# EasyEDA Pro project NewTalphaTHM.eprj

# Schematic THM V2

## Sheets
1 MainBoard: Create Date: 2023-01-20; Page Name: MainBoard; Project Name: NewTalphaTHM; Schematic Name: THM V2; Update Date: 2023-04-03; Company: PT AKA; Drawed: Hanif Fadh; Page Size: A4; Part Number: THM-1; Reviewed: Hanif Fadh; Version: V2
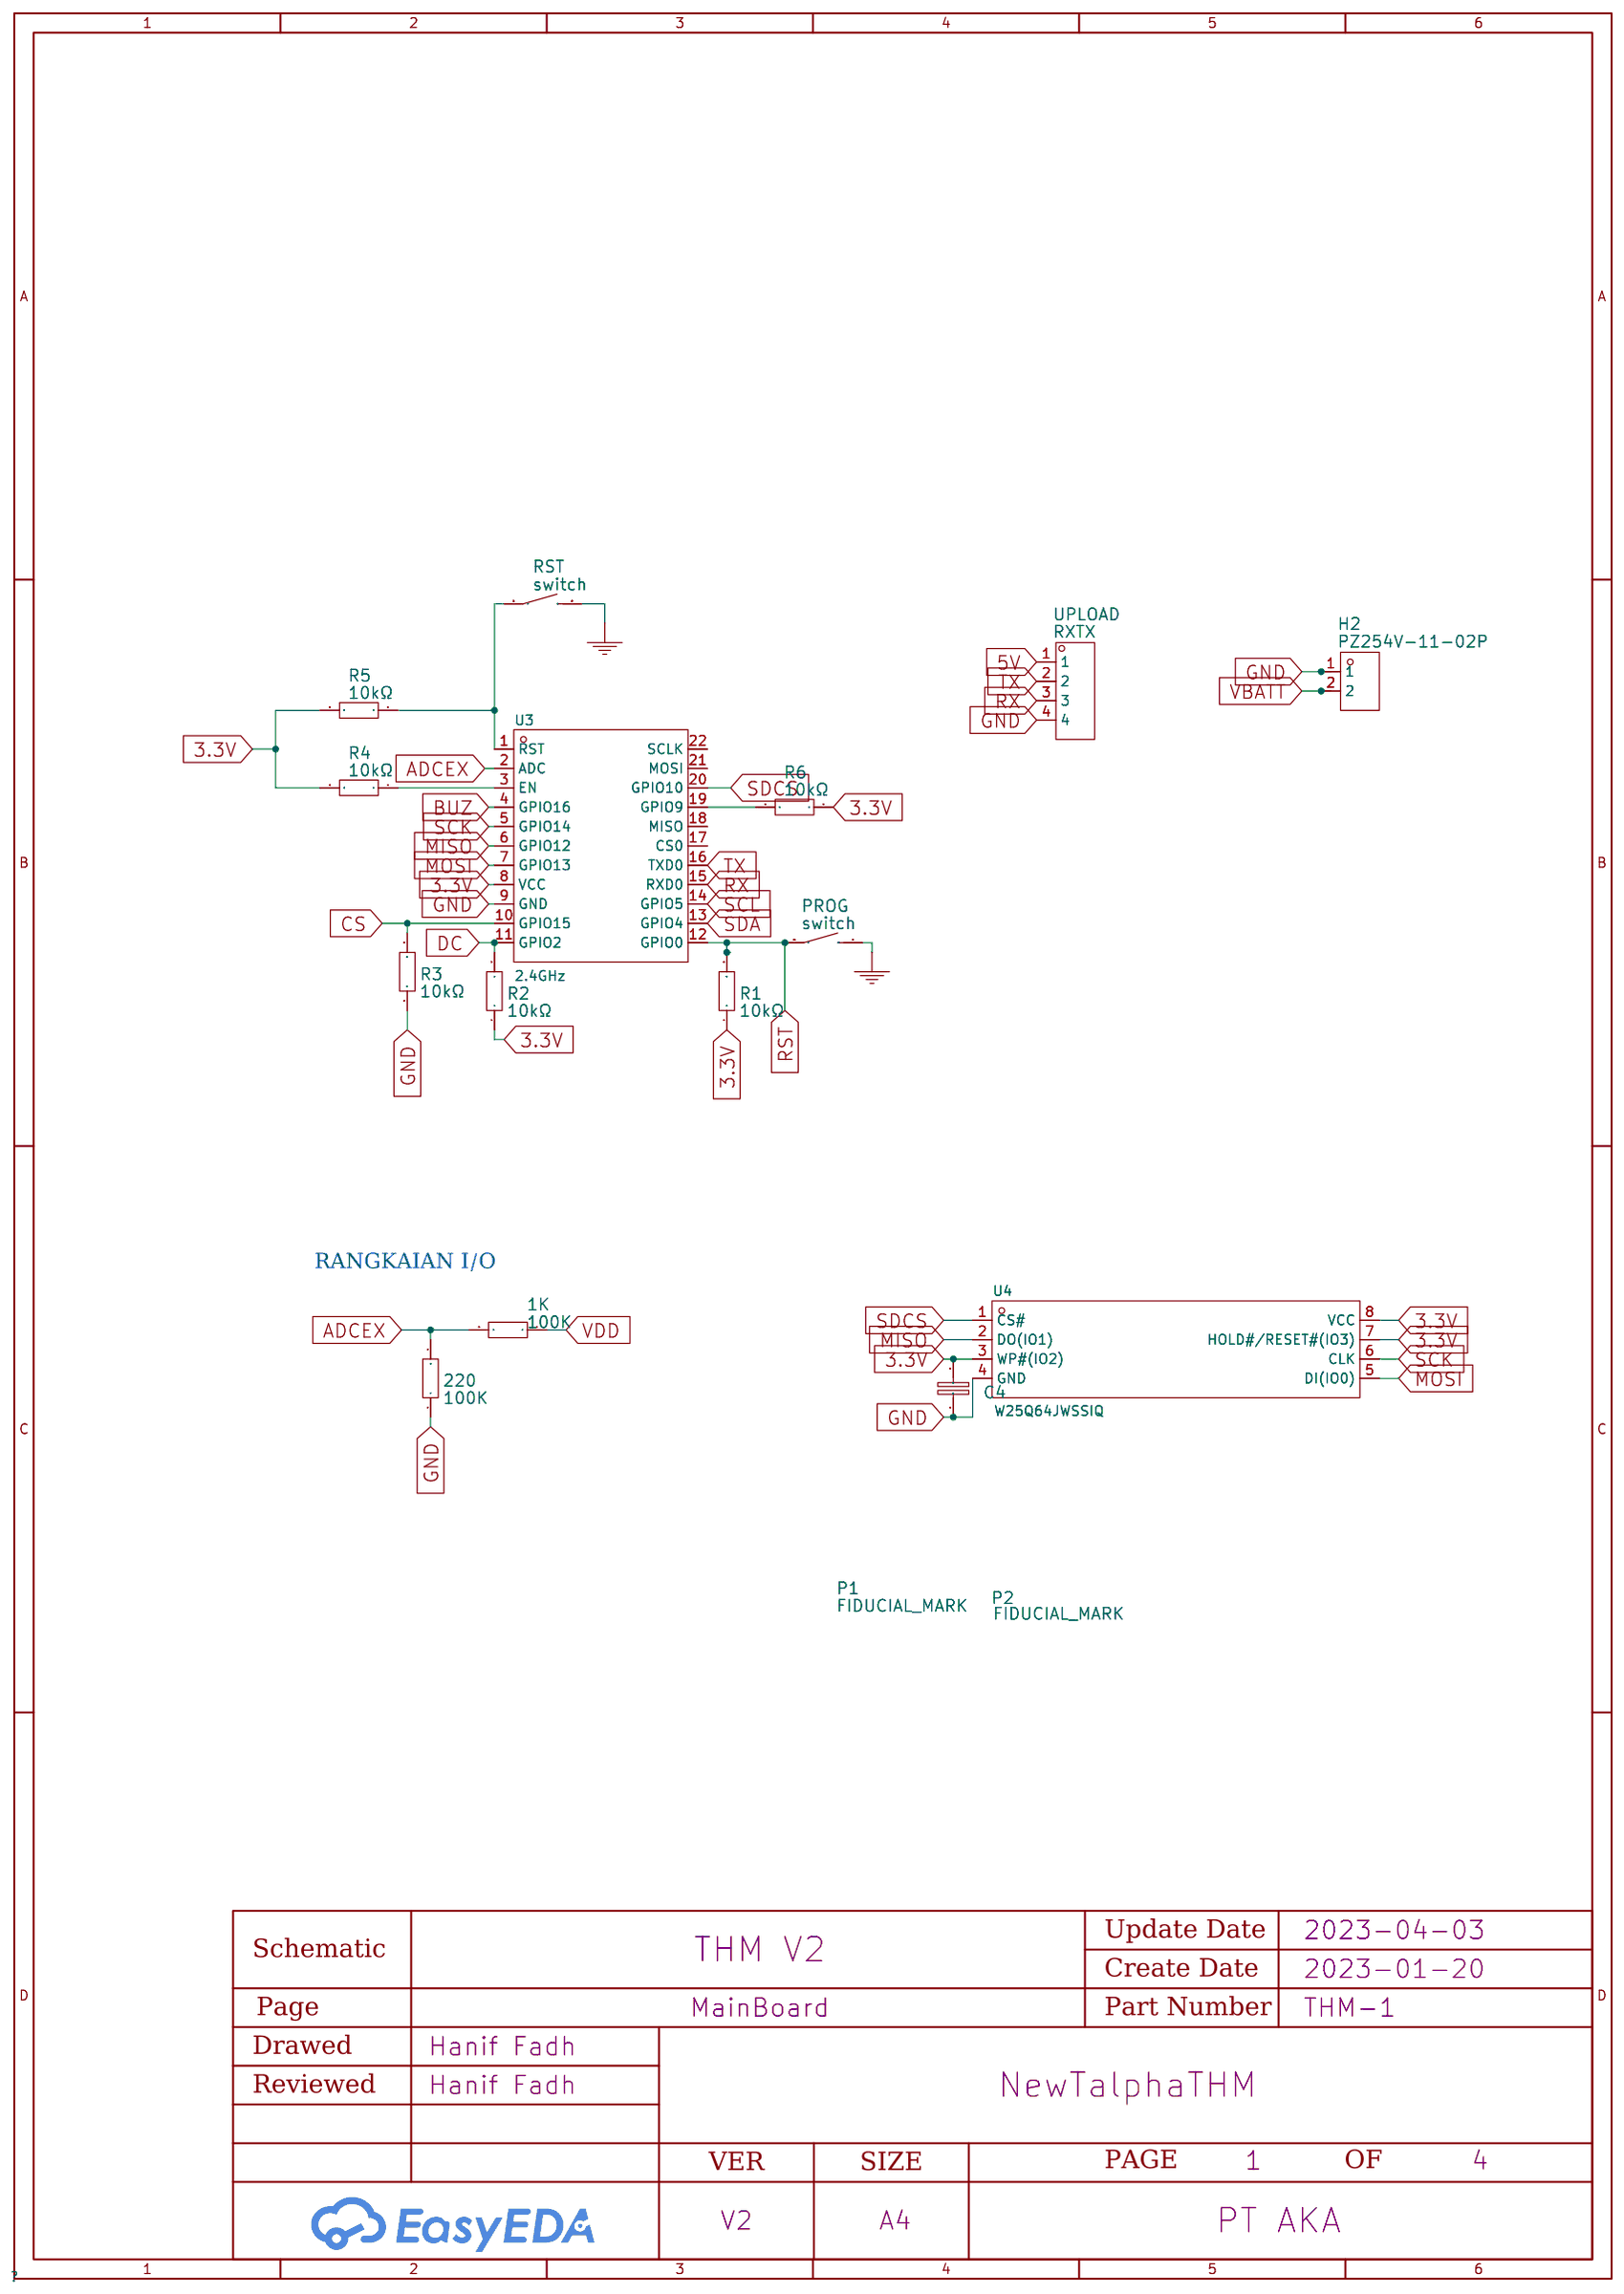
[diagram p0: MainBoard]
2 TFT ILI9341: Page Name: TFT ILI9341; Update Date: 2023-01-20; Part Number: TALPHA-1
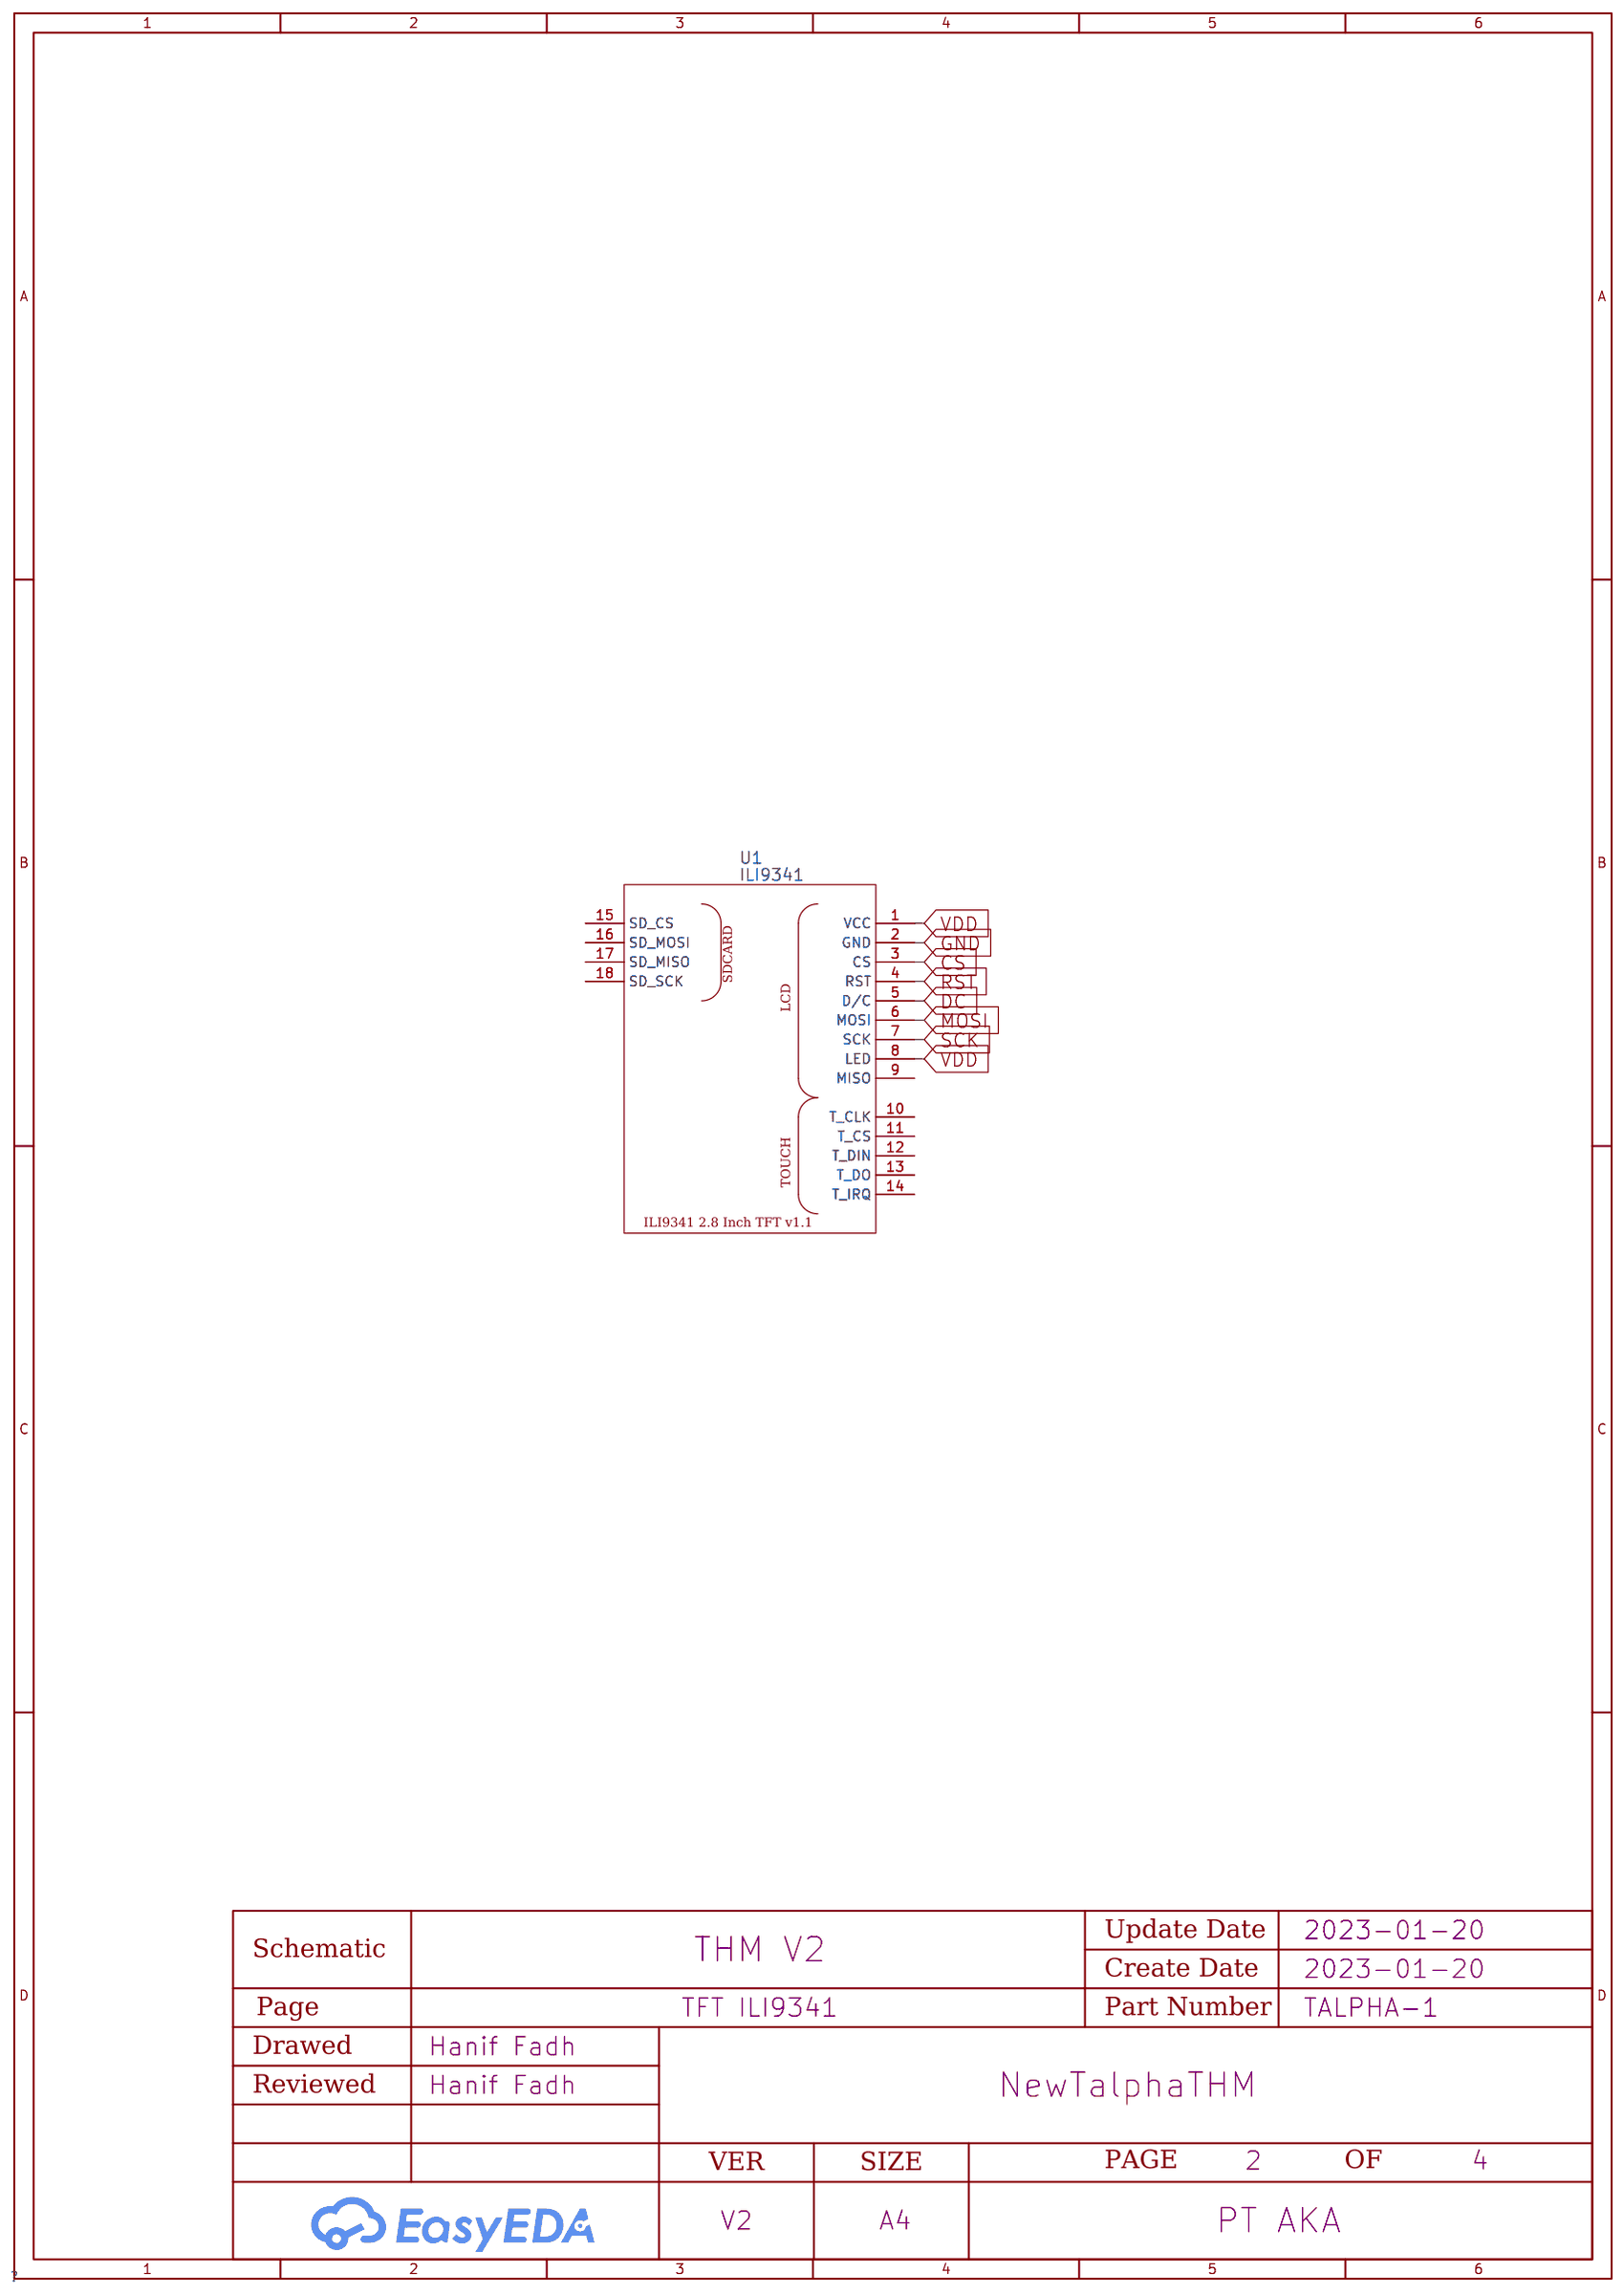
[diagram p1: TFT ILI9341]
3 Power Path: Page Name: Power Path; Update Date: 2023-05-22; Drawed: hanif Fadh; Reviewed: Hanif fadh
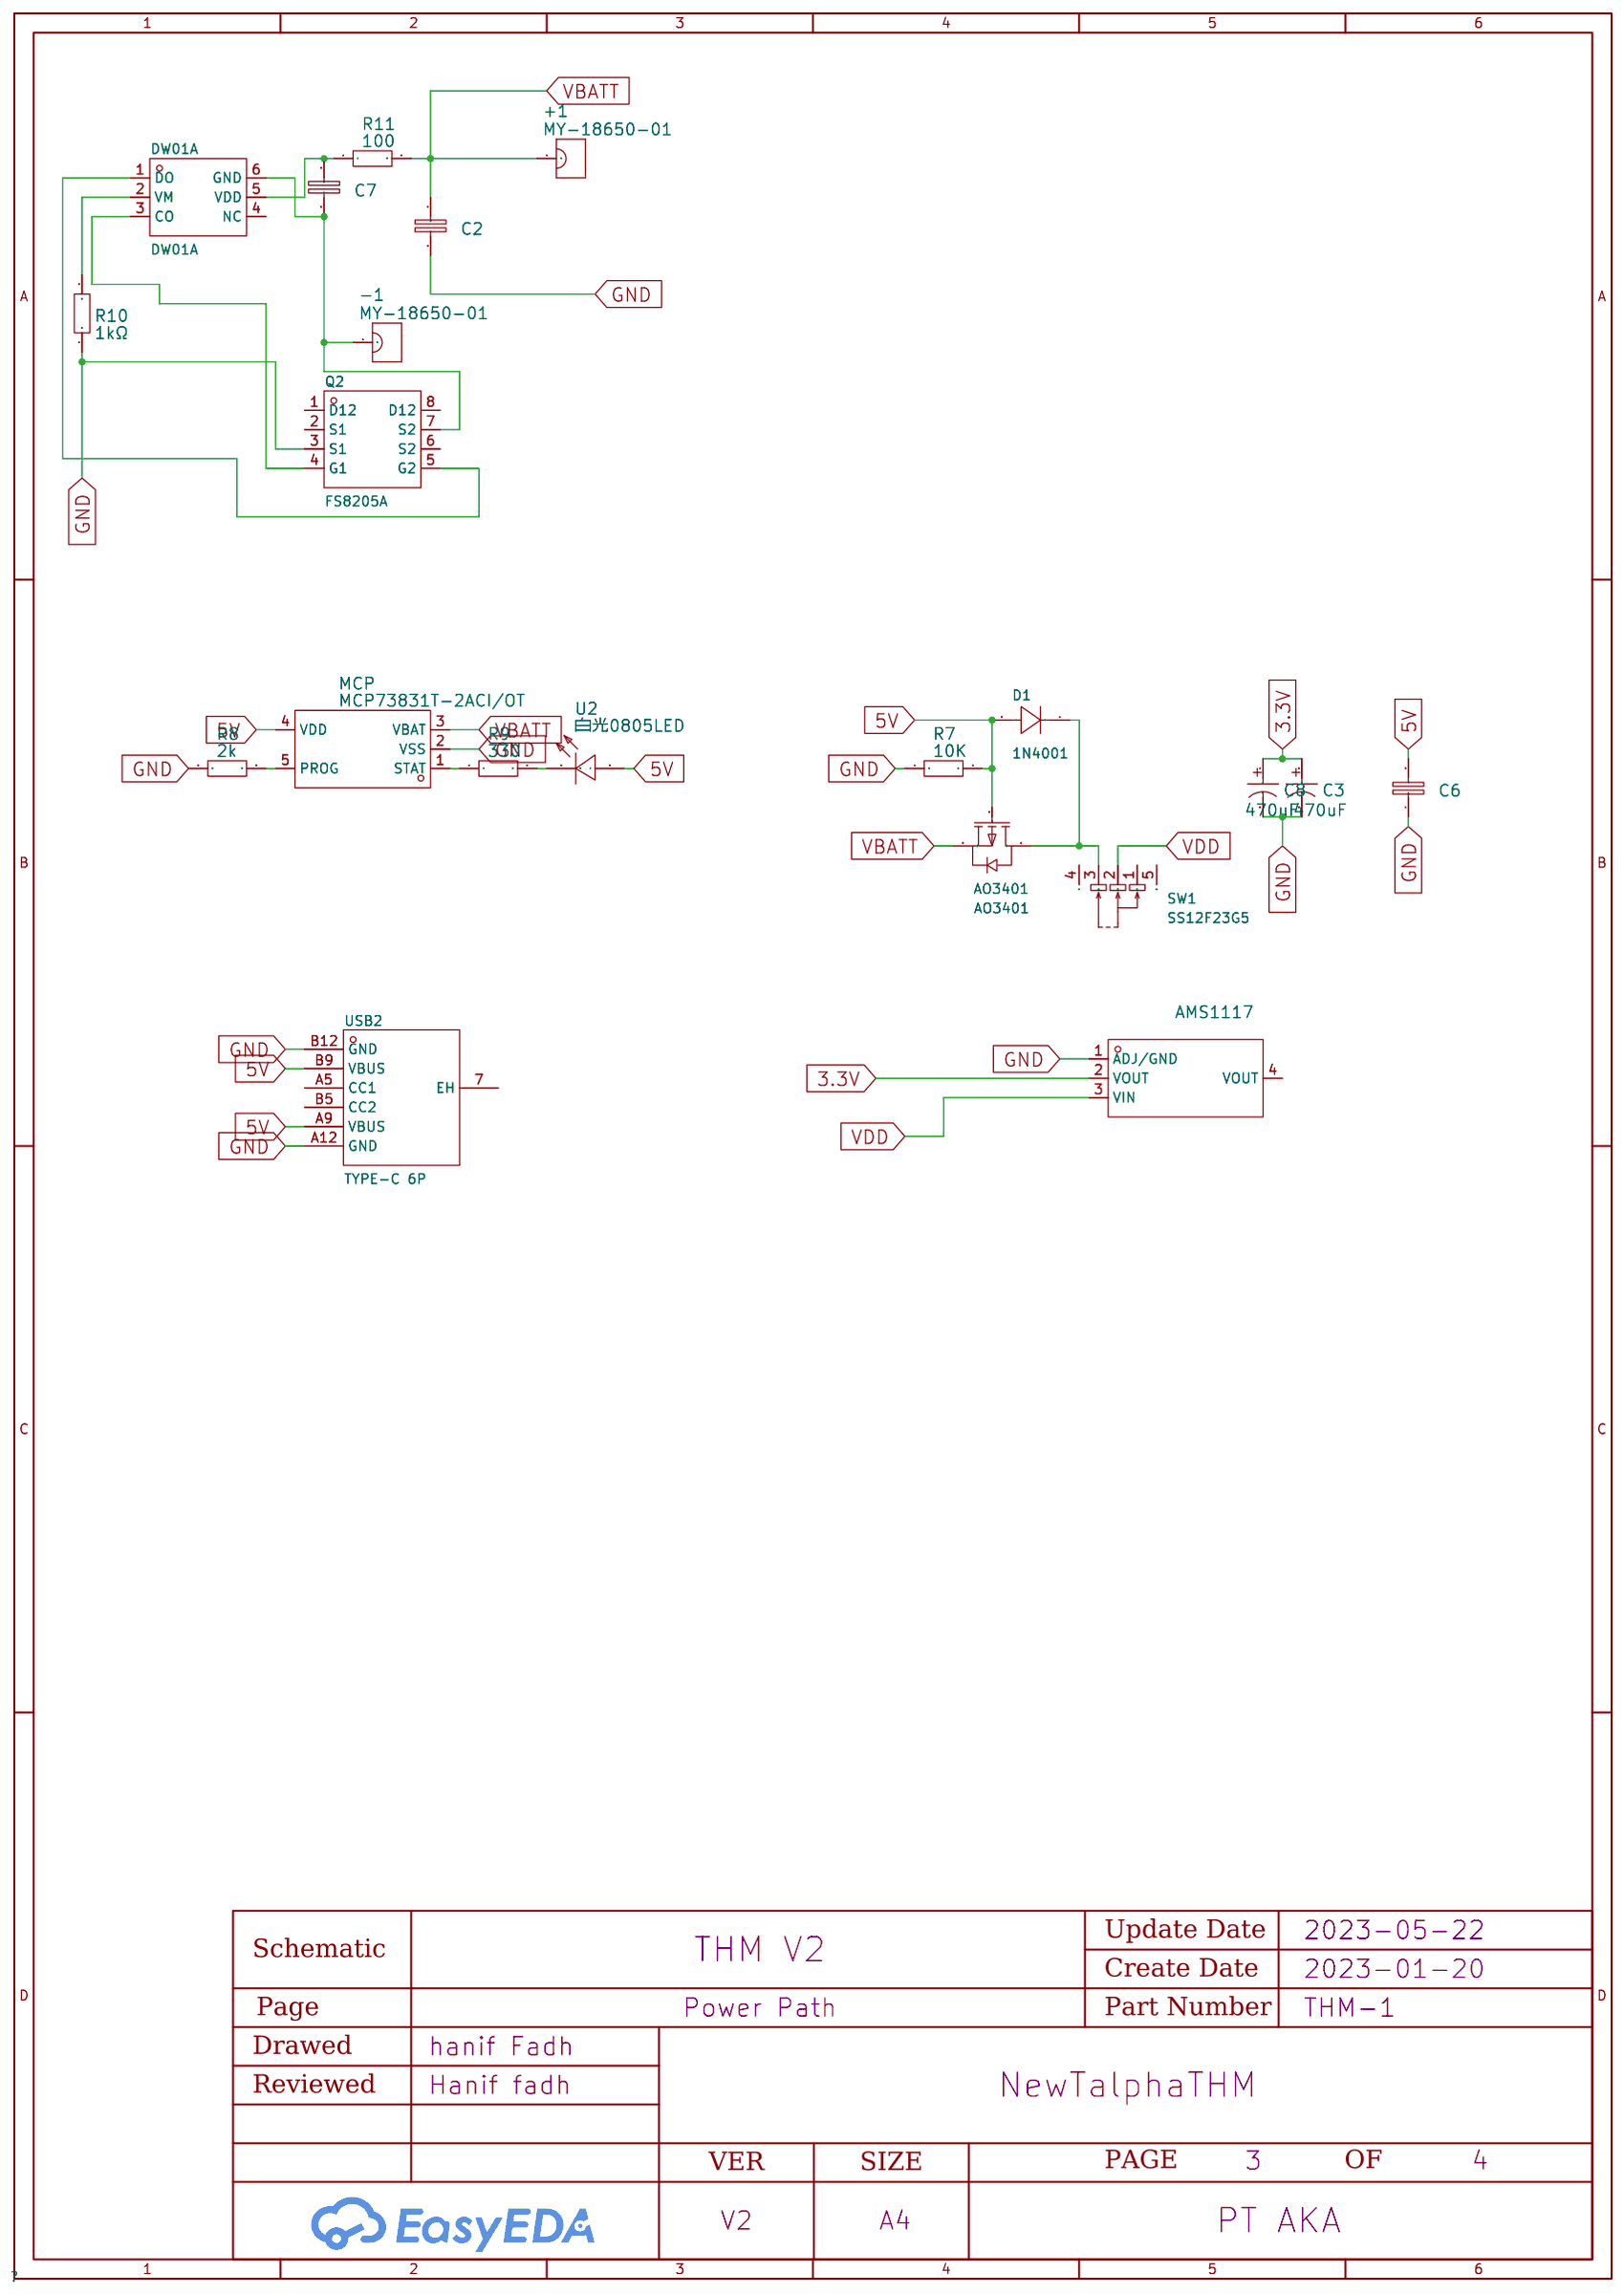
[diagram p2: Power Path]
4 Sensor HTU: Page Name: Sensor HTU; Update Date: 2023-02-21; Version: V02
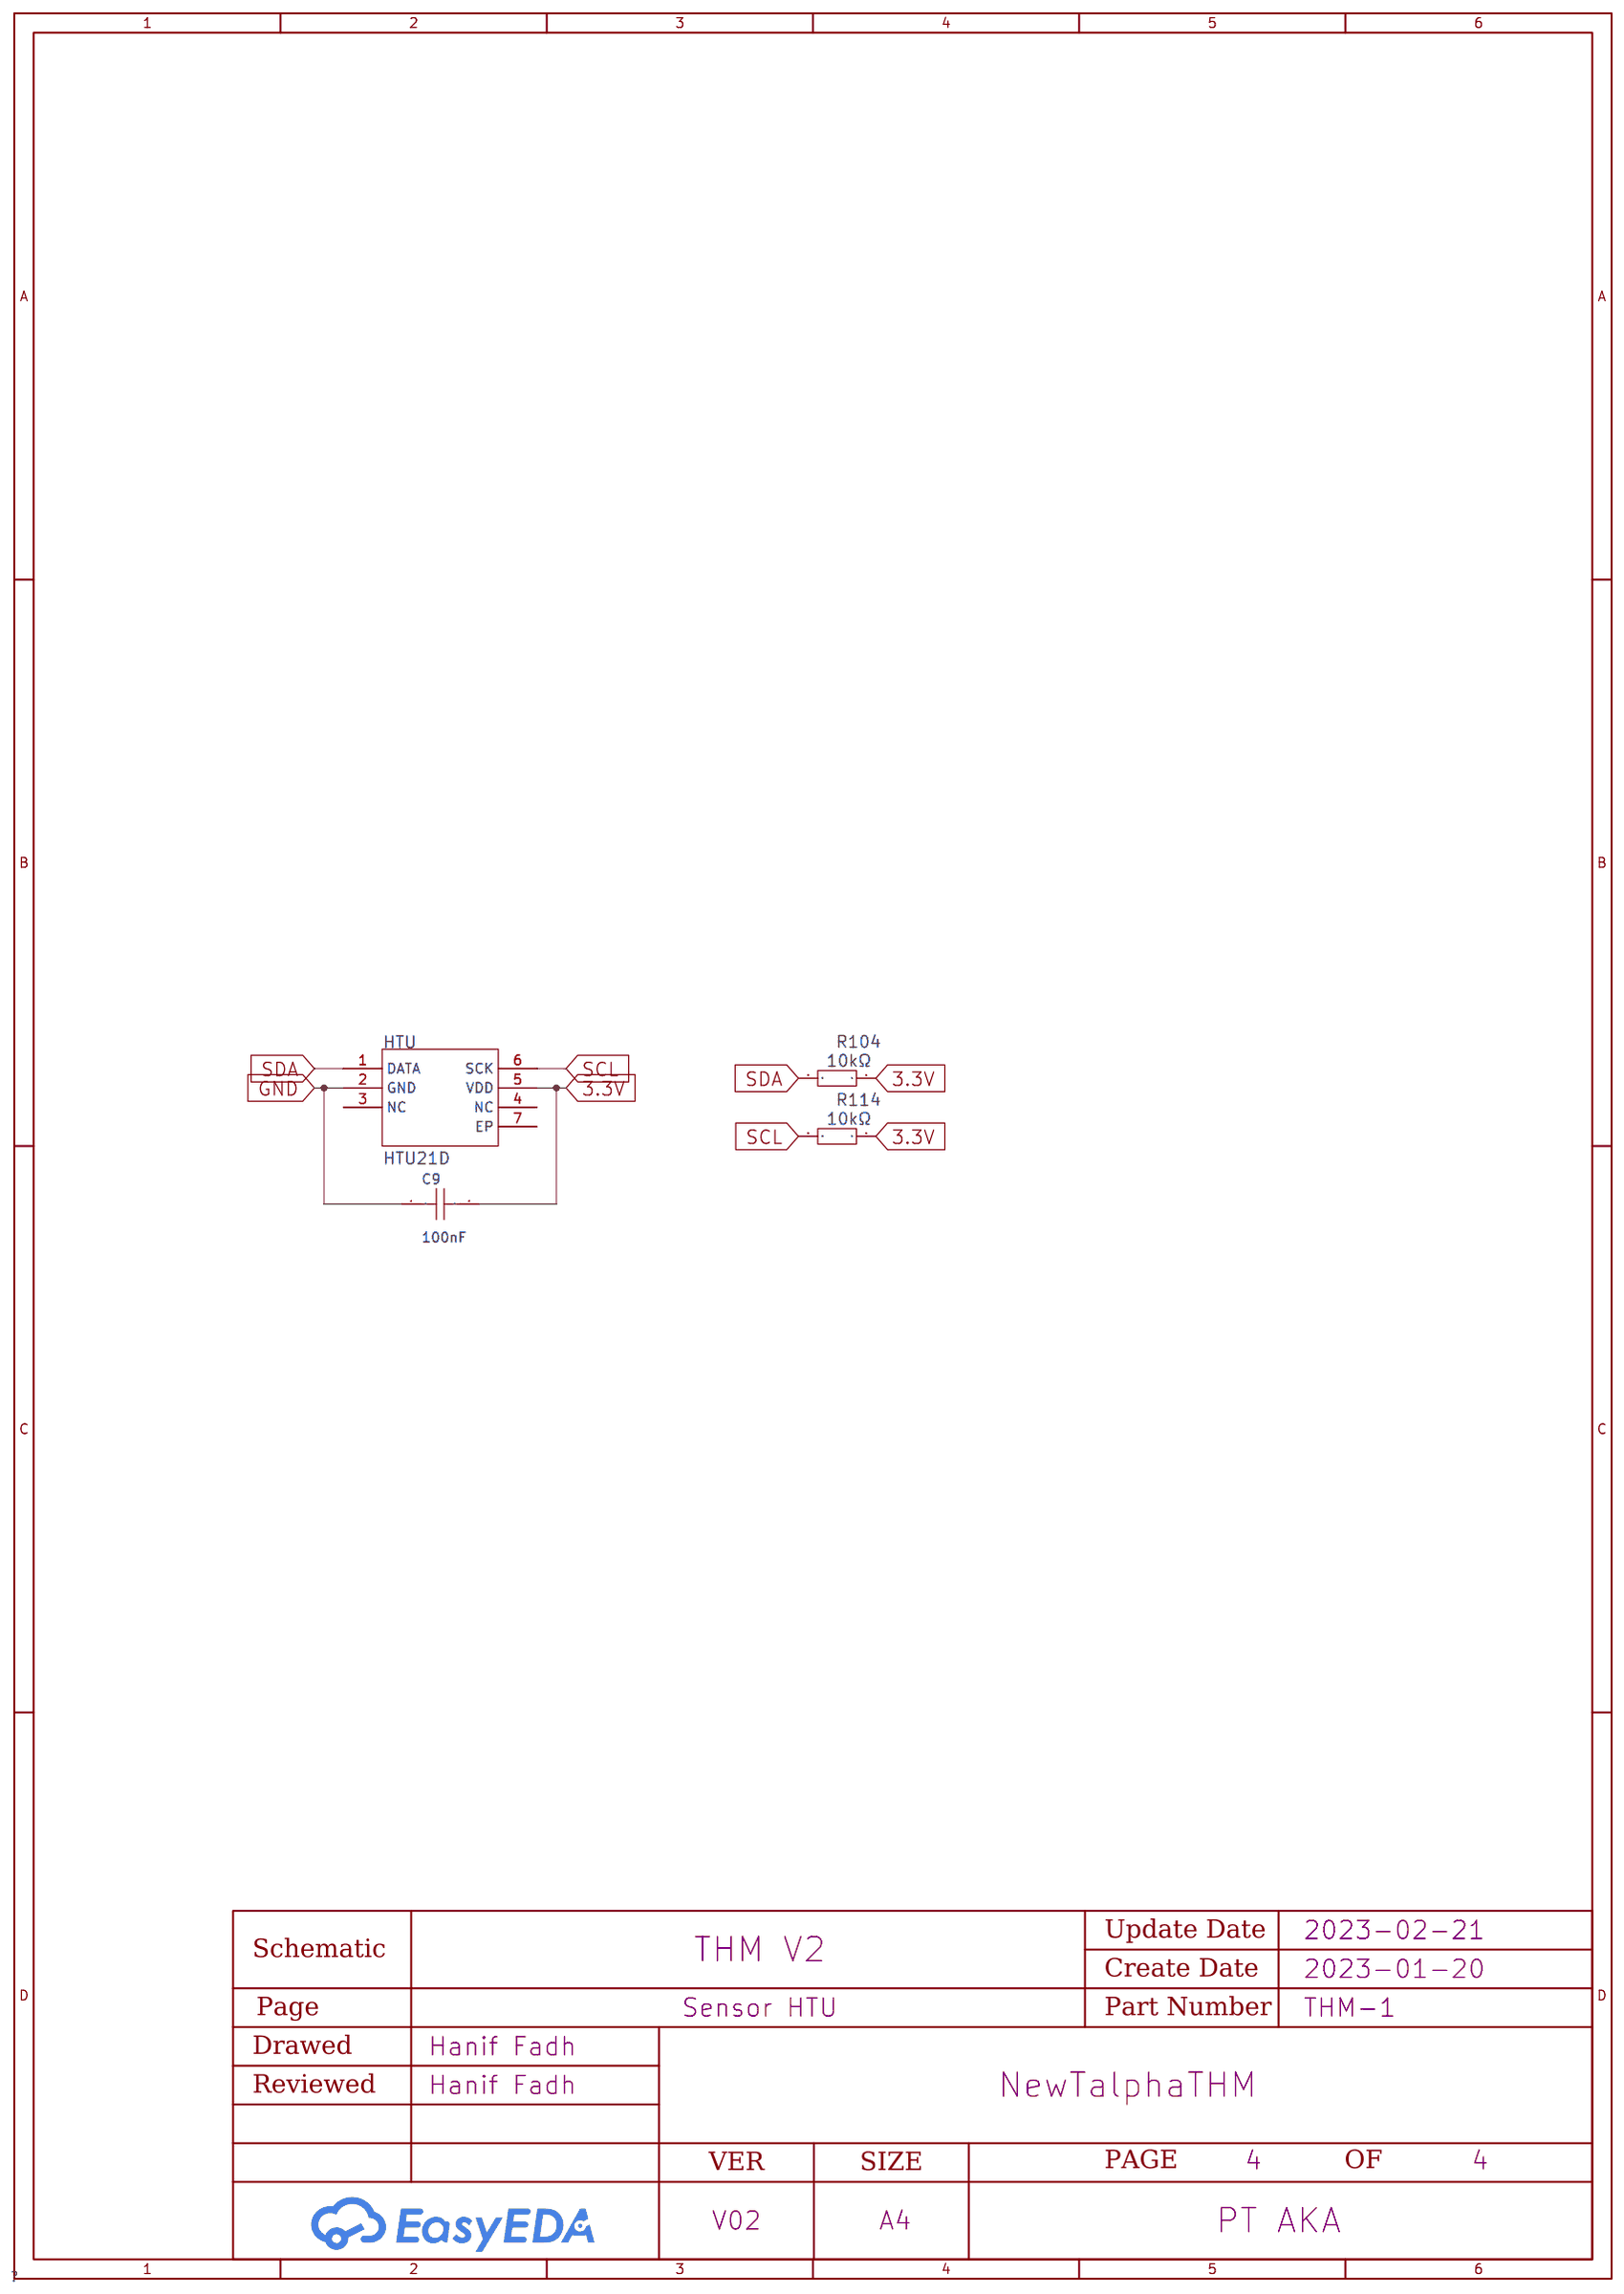
[diagram p3: Sensor HTU]

## Parts
sheet MainBoard
1K  100K  [R0805]
220  100K  [R0805]
C4  CSMD  [CAPACITOR-SMD]
H2  PZ254V-11-02P  [HDR-TH_2P-P2.54-V-M]
P1  FIDUCIAL_MARK  [FIDUCIAL_MARK]
P2  FIDUCIAL_MARK  [FIDUCIAL_MARK]
PROG  switch  [TACTILE-SWITCH-1101NE]
R1  10kΩ  [R0805]
R2  10kΩ  [R0805]
R3  10kΩ  [R0805]
R4  10kΩ  [R0805]
R5  10kΩ  [R0805]
R6  10kΩ  [R0805]
RST  switch  [TACTILE-SWITCH-1101NE]
U3  2.4GHz  [WIFIM-SMD_ESP-12F-ESP8266MOD]
U4  W25Q64JWSSIQ  [SOIC-8_L5.3-W5.3-P1.27-LS8.0-BL]
UPLOAD  RXTX  [HDR-TH_4P-P2.54-V-M]
sheet Power Path
+1  MY-18650-01  [BAT-TH_MY-18650-01]
-1  MY-18650-01  [BAT-TH_MY-18650-01]
AMS1117  AMS1117-3.3_C426566  [SOT-223_L6.5-W3.5-P2.30-LS7.0-BR]
AO3401  AO3401  [SOT-23-3_L2.9-W1.4-P1.90-LS2.6-BR]
C2  CSMD  [CAPACITOR-SMD]
C3  470uF  [CAP-SMD_L7.3-W4.3]
C6  4.7uf  [CAPACITOR-SMD]
C7  CSMD  [CAPACITOR-SMD]
C8  470uF  [CAP-SMD_L7.3-W4.3]
D1  1N4001  [SMA_L4.3-W2.5-LS5.0-RD]
DW01A  DW01A  [SOT-23-6_L2.9-W1.6-P0.95-LS2.8-BL]
MCP  MCP73831T-2ACI/OT  [SOT-23-5_L3.0-W1.7-P0.95-LS2.8-BR]
Q2  FS8205A  [TSSOP-8_L4.4-W3.0-P0.65-LS6.4-BL-2]
R7  10K  [0805]
R8  2k  [0805]
R9  330  [0805]
R10  1kΩ  [R0805]
R11  100  [0805]
SW1  SS12F23G5  [SW-TH_SHOU-HAN_SS12F23G5]
U2  白光0805LED  [LED0805-RD_WHITE]
USB2  TYPE-C 6P  [TYPE-C-SMD_TYPE-C-6P]
sheet Sensor HTU
C9  100nF  [C0805]
HTU  HTU21D  [DFN-6_L3.0-W3.0-P1.00-BL-EP]
R104  10kΩ  [R0805]
R114  10kΩ  [R0805]
sheet TFT ILI9341
U1  ILI9341  [ILI9341-2.8]

## Library data of the parts
1K 220 = 100K: link: https://item.szlcsc.com/142685.html; 3DModel: R0805_L2.0-W1.3-H0.6; Supplier: LCSC; Supplier Part: C328379; Manufacturer: ResistorToday; Manufacturer Part: AECR0805F100KK9
C2 C4 C7 = CSMD
H2 = PZ254V-11-02P: link: https://lcsc.com/product-detail/Pin-Header-Female-Header_Made-in-China-Made-in-China-2-54mm-1-2P_C36717.html; 3DModel: HDR2.54-M-LI-1X2P; Supplier: LCSC; Supplier Part: C492401; Manufacturer: XFCN(兴飞); JLCPCB Part Class: Extended Part
P1 P2 = FIDUCIAL_MARK
PROG RST = switch
R1-R6 R10 R104 R114 = 10kΩ: link: https://item.szlcsc.com/142685.html; 3DModel: R0805_L2.0-W1.3-H0.6; Supplier: LCSC; Manufacturer: UNI-ROYAL(厚声); Manufacturer Part: 0805W8F1002T5E; Supplier Part: C17414; Resistance: 10K; JLCPCB Part Class: Basic Part
U3 = ESP-12F(ESP8266MOD): Frequency:2.4GHz Output Power:16dBm Output Power:16dBm Core Processor:ESP8266 Support Interface:GPIO；UART；IIC；PWM；SPI；ADC Antenna Type:PCB 板载天线 Wireless Standard:802.11b/g/n Operating Voltage:3.3V Operating Voltage:3.3V Receive  Current:120mA Send  Curren; Supplier Part: C82891; Manufacturer: Ai-Thinker(安信可); Supplier Footprint: WIFI Module; JLCPCB Part Class: Extended Part; Datasheet: https://atta.szlcsc.com/upload/public/pdf/source/20210219/C82891_ABD84A460F4F056A2757267CCCA4B508.pdf; Supplier: LCSC; Output Power: 16dBm; Core Processor: ESP8266; Support Interface: GPIO；UART；IIC；PWM；SPI；ADC; Antenna Type: PCB 板载天线; Wireless Standard: 802.11b/g/n; Operating Voltage: 3.3V; Receive  Current: 120mA; Send  Current: 170mA; Sensitivity: -90dBm; Operating Temperature: -40℃~+85℃
U4 = W25Q64JWSSIQ: Supplier Part: C2985658; Manufacturer: WINBOND(华邦); Supplier Footprint: SOIC-8; JLCPCB Part Class: Extended Part; Datasheet: https://atta.szlcsc.com/upload/public/pdf/source/20210420/C2595075_E7A7725B7CF2DE50C07916BF10CAF3A1.pdf; Supplier: LCSC
UPLOAD = RXTX: link: https://item.szlcsc.com/502959.html; 3DModel: HDR-TH_4P-P2.54-M-LI-1X4P; Supplier: LCSC; Manufacturer: ReliaPro; Manufacturer Part: Headers  Pins 1*4P; Supplier Part: C59481
+1 -1 = MY-18650-01: link: https://atta.szlcsc.com/upload/public/pdf/source/20220302/9B78703FC9BDD52215F97855EB9B4A89.pdf; Supplier: LCSC; Supplier Part: C2979183; Manufacturer: MYOUNG(美阳); JLCPCB Part Class: Extended Part
AMS1117 = AMS1117-3.3_C426566: link: https://item.szlcsc.com/109711.html; 3DModel: SOT-223-4P_L6.5-W3.5-H1.6-LS7.0-P2.30; Supplier: LCSC; Supplier Part: C426566; Manufacturer: SLKORMICRO Elec.; Manufacturer Part: AMS1117-3.3; JLCPCB Part Class: Extended Part
AO3401 = AO3401_C727156: Type: Drain Source Voltage (Vdss): Continuous Drain Current (Id): Power Dissipation (Pd): Drain Source On Resistance (RDS(on)@Vgs,Id):65mΩ@10V,4.2A Gate Threshold Voltage (Vgs(th)@Id):1.3V@250uA Total Gate Charge (Qg@Vgs):- Input Capacitance (Ciss@Vds):-; LCSC Part Name: P沟道 30V 4.2A; Supplier Part: C727156; Manufacturer: TWGMC(台湾迪嘉); Supplier Footprint: SOT-23; JLCPCB Part Class: Extended Part; Datasheet: https://atta.szlcsc.com/upload/public/pdf/source/20200827/C727156_6E081BBEEFBC6B8FEE164CB196B0AF30.pdf; Supplier: LCSC; Drain Source On Resistance (RDS(on)@Vgs,Id): 65mΩ@10V,4.2A; Gate Threshold Voltage (Vgs(th)@Id): 1.3V@250uA
C3 C8 = 470uF: link: https://item.szlcsc.com/292603.html; 3DModel: CASE-E_L7.3-W4.3-H4.1; Supplier: LCSC; Supplier Part: C444766; Manufacturer: AVX; Manufacturer Part: TAJE477K006RNJ; JLCPCB Part Class: Extended Part
C6 = 4.7uf
D1 = 1N4001_C727079: Diode Configuration: Reverse Voltage (Vr): Average Rectified Current (Io): Forward Voltage (Vf@If):1.1V@1A Reverse Leakage Current:5uA@50V; LCSC Part Name: 50V 1A 1.1V@1A; Supplier Part: C727079; Manufacturer: TWGMC(台湾迪嘉); Supplier Footprint: SMA(DO-214AC); JLCPCB Part Class: Extended Part; Datasheet: https://atta.szlcsc.com/upload/public/pdf/source/20200828/C727079_3A05254382567072883400655AE0ED46.pdf; Supplier: LCSC; Forward Voltage (Vf@If): 1.1V@1A; Reverse Leakage Current: 5uA@50V
DW01A = DW01A_C436931: Supplier Part: C436931; Manufacturer: TF(拓锋); Supplier Footprint: SOT-23-6; JLCPCB Part Class: Extended Part; Datasheet: https://atta.szlcsc.com/upload/public/pdf/source/20191121/C436931_2F3233FCEFFE76204A0A035C9B3278D6.pdf; Supplier: LCSC
MCP = MCP73831T-2ACI/OT: link: https://item.szlcsc.com/236104.html; 3DModel: SOT-23-5_L2.9-W1.6-H1.1-LS2.8-P0.95; Supplier: LCSC; Supplier Part: C424093; Manufacturer: Microchip Tech; JLCPCB Part Class: Extended Part
Q2 = FS8205A_C16052: Type:2 N-Channel Drain Source Voltage (Vdss): Continuous Drain Current (Id): Power Dissipation (Pd): Drain Source On Resistance (RDS(on)@Vgs,Id):25mΩ@4.5V,4A Gate Threshold Voltage (Vgs(th)@Id):1V@250uA; LCSC Part Name: 2个N沟道 20V 6A; Supplier Part: C16052; Manufacturer: FORTUNE(富晶); Supplier Footprint: TSSOP-8(3x4.4x0.65); JLCPCB Part Class: Extended Part; Datasheet: https://atta.szlcsc.com/upload/public/pdf/source/20140228/1457706997167.pdf; Supplier: LCSC; Type: 2 N-Channel; Drain Source On Resistance (RDS(on)@Vgs,Id): 25mΩ@4.5V,4A; Gate Threshold Voltage (Vgs(th)@Id): 1V@250uA
R7 R8 R11 = 2k: Supplier: LCSC; Supplier Part: C351618; Manufacturer: ResistorToday; Manufacturer Part: PTFR0805B110RN9
R9 = 330: Supplier: LCSC; Supplier Part: C351618; Manufacturer: ResistorToday; Manufacturer Part: PTFR0805B110RN9
SW1 = SS12F23G5_C2887262: Supplier Part: C2887262; Manufacturer: SHOU HAN(首韩); Supplier Footprint: 插件; JLCPCB Part Class: Extended Part; Datasheet: https://atta.szlcsc.com/upload/public/pdf/source/20210820/8DF548496CDB4CE32B9521DC9B5D5E7D.pdf; Supplier: LCSC
U2 = 白光0805LED: link: https://item.szlcsc.com/255094.html; 3DModel: LED0805-RD; Supplier: LCSC; Supplier Part: C9900017662; Manufacturer: null; JLCPCB Part Class: Extended Part
USB2 = TYPE-C 6P: Connector Type:Type-C Standard:- Gender:Female Number of Contacts:6 Number of Ports:1 Mounting Style:Surface Mount Current Rating - Power (Max):- Operating Temperature Range:-40℃~+85℃ Operating Temperature Range:-40℃~+85℃; LCSC Part Name: Type-C 母座 卧贴; Supplier Part: C456012; Manufacturer: SHOU HAN(首韩); Supplier Footprint: SMD; JLCPCB Part Class: Extended Part; Datasheet: https://atta.szlcsc.com/upload/public/pdf/source/20201203/C456012_B13F72044DF846EDBE9BDD0D1D3CD166.pdf; Supplier: LCSC; Connector Type: Type-C; Gender: Female; Number of Contacts: 6; Number of Ports: 1; Mounting Style: Surface Mount; Operating Temperature Range: -40℃~+85℃
C9 = C0805X104K101TB: Capacitance: Tolerance:±10% Tolerance:±10% Voltage Rated: Temperature Coefficient:; LCSC Part Name: 100nF ±10% 100V; Supplier Part: C495959; Manufacturer: IHHEC(禾伸堂); Supplier Footprint: 0805; JLCPCB Part Class: Extended Part; Datasheet: https://atta.szlcsc.com/upload/public/pdf/source/20200117/C485772_1C2A03D89DC7D3F931FB9AFBA2903E68.pdf; Supplier: LCSC; Tolerance: ±10%
HTU = HTU21D: link: https://atta.szlcsc.com/upload/public/pdf/source/20200622/C516769_839DCBAACB81EF4B150C7042835912F3.pdf; 3DModel: DFN-6_L3.0-W3.0-H1.2-P1.00; Supplier: LCSC; Manufacturer: TE Connectivity(美国泰科); Supplier Part: C83479; JLCPCB Part Class: Extended Part
U1 = ILI9341: 3DModel: TFT-ILI9341-2.8"-WL

## Nets
3.3V: AMS1117.2(VOUT) C3.1 C4.2 C8.1 C9.2 HTU.5(VDD) R1.1 R2.1 R4.2 R5.2 R6.1 R104.1 R114.1 U3.8(VCC) U4.3(WP#(IO2)) U4.7(HOLD#/RESET#(IO3)) U4.8(VCC)
5V: AO3401.1(G) C6.2 D1.2(A) MCP.4(VDD) R7.2 U2.2(A) UPLOAD.1 USB2.A9(VBUS) USB2.B9(VBUS)
GND: 220.1 AMS1117.1(ADJ/GND) C2.2 C3.2 C4.1 C6.1 C8.2 C9.1 H2.1 HTU.2(GND) MCP.2(VSS) PROG.P$2(2) Q2.3(S1) R3.1 R7.1 R8.1 R10.1 RST.P$2(2) U1.2(GND) U3.9(GND) U4.4(GND) UPLOAD.4 USB2.A12(GND) USB2.B12(GND)
VBATT: +1.1 AO3401.2(S) C2.1 H2.2 MCP.3(VBAT) R11.2
VDD: 1K.1 AMS1117.3(VIN) SW1.2 U1.1(VCC) U1.8(LED)
ADCEX: 1K.2 220.2 U3.2(ADC)
BUZ: U3.4(GPIO16)
CS: R3.2 U1.3(CS) U3.10(GPIO15)
DC: R2.2 U1.5(D/C) U3.11(GPIO2)
MISO: U3.6(GPIO12) U4.2(DO(IO1))
MOSI: U1.6(MOSI) U3.7(GPIO13) U4.5(DI(IO0))
RST: PROG.P$1(1) R1.2 U1.4(RST) U3.12(GPIO0)
RX: U3.15(RXD0) UPLOAD.3
SCK: U1.7(SCK) U3.5(GPIO14) U4.6(CLK)
SCL: HTU.6(SCK) R114.2 U3.14(GPIO5)
SDA: HTU.1(DATA) R104.2 U3.13(GPIO4)
SDCS: U3.20(GPIO10) U4.1(CS#)
TX: U3.16(TXD0) UPLOAD.2
$1N78: R5.1 RST.P$1(1) U3.1(RST)
$1N79: R4.1 U3.3(EN)
$1N246: R6.2 U3.19(GPIO9)
$3N814: MCP.1(STAT) R9.1
$3N815: R9.2 U2.1(C)
$3N819: MCP.5(PROG) R8.2
$3N1149: AO3401.3(D) D1.1(K) SW1.3
$3N6731: DW01A.3(CO) Q2.4(G1)
$3N6752: DW01A.1(DO) Q2.5(G2)
$3N6843: DW01A.2(VM) R10.2
$3N7242: -1.1 C7.2 DW01A.6(GND) Q2.7(S2)
$3N7253: C7.1 DW01A.5(VDD) R11.1

Not connected (* = marked no-connect by the designer): AMS1117 4(VOUT); DW01A 4(NC); HTU 3(NC) 4(NC) 7(EP); Q2 1(D12) 2(S1) 6(S2) 8(D12); SW1 1 4 5; U1 9(MISO) 10(T_CLK) 11(T_CS) 12(T_DIN) 13(T_DO) 14(T_IRQ) 15(SD_CS) 16(SD_MOSI) 17(SD_MISO) 18(SD_SCK); U3 17(CS0) 18(MISO) 21(MOSI) 22(SCLK); USB2 7(EH) A5(CC1) B5(CC2)

## Notes on the sheets
sheet 1
- RANGKAIAN I/O

# Board PCB THM V2
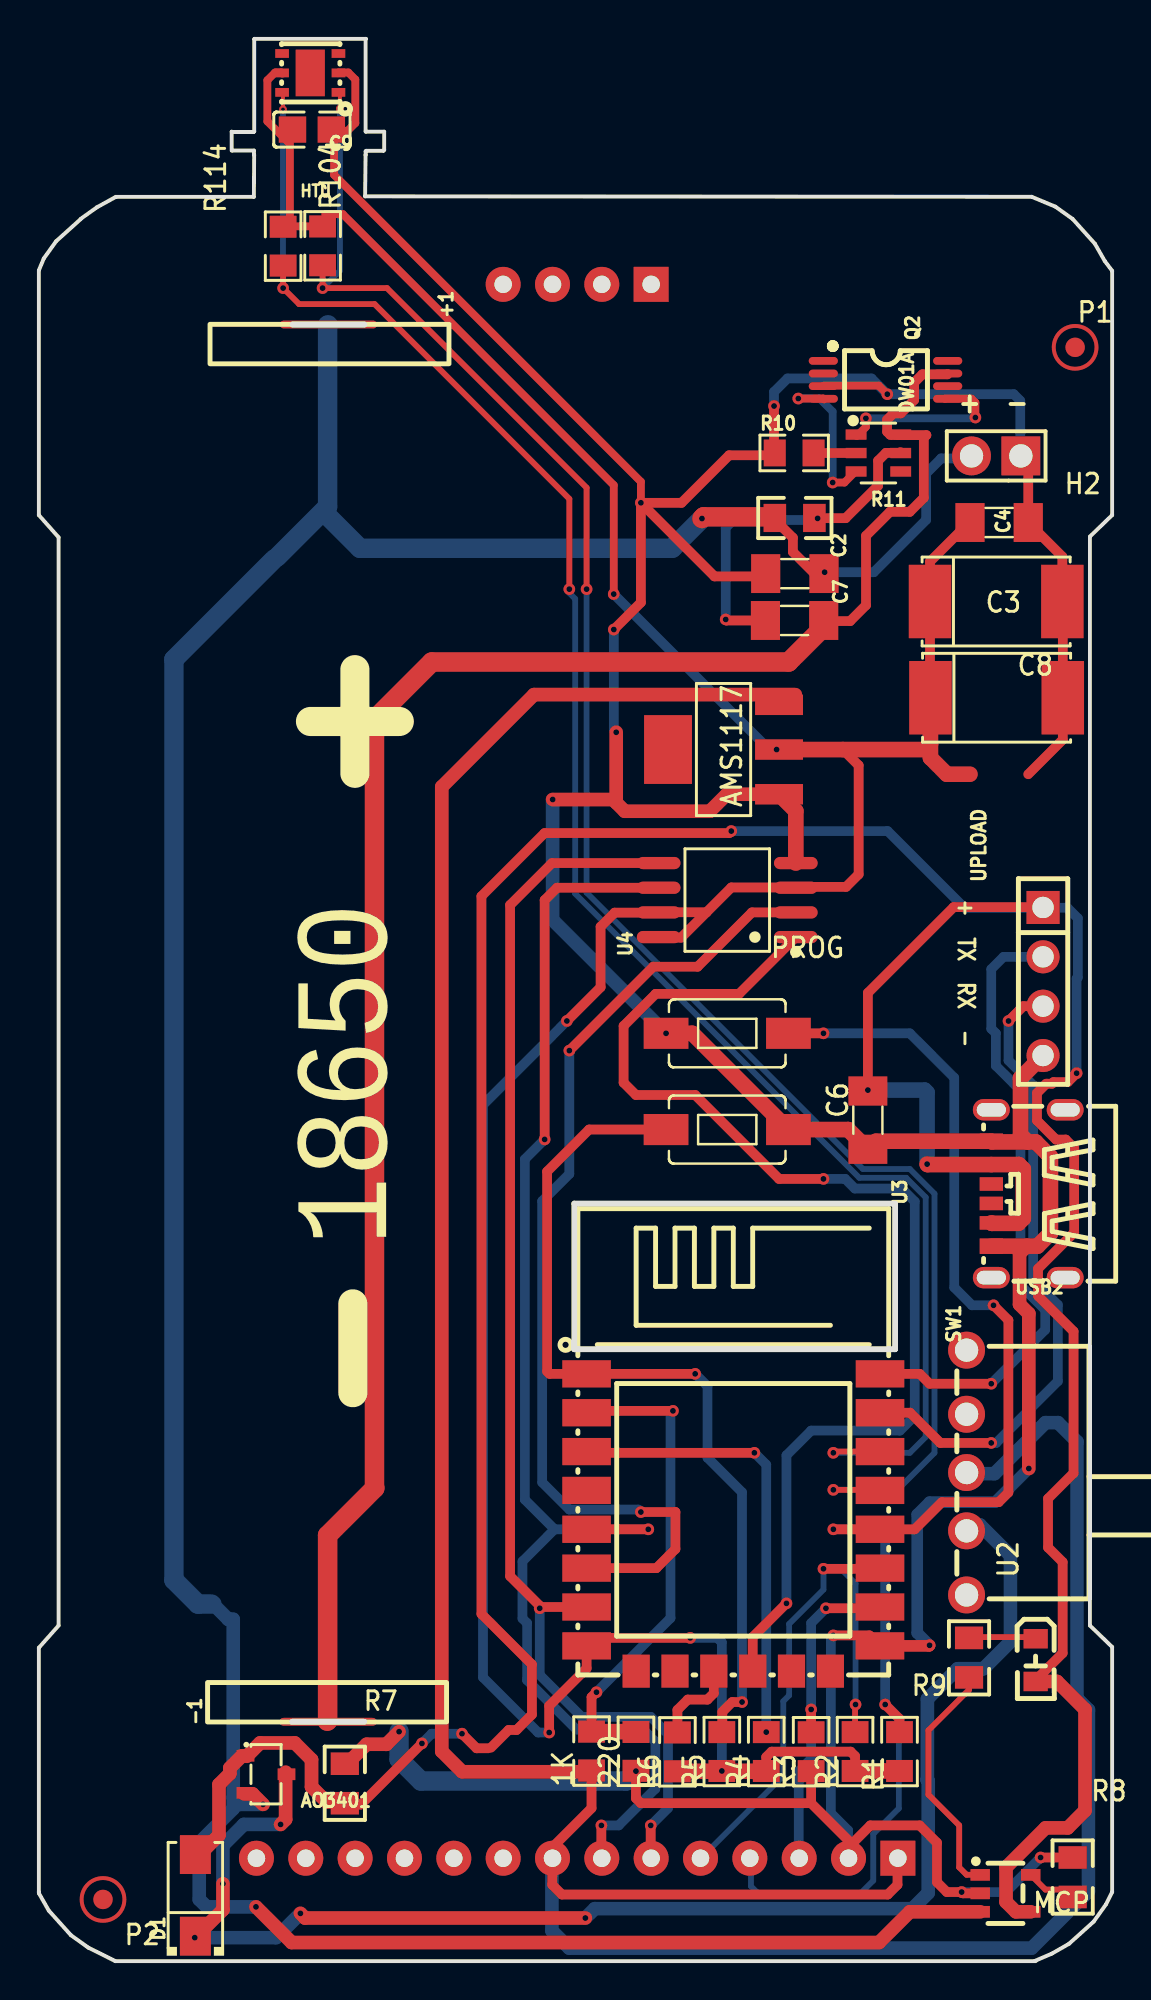
[diagram p4: board, top side]
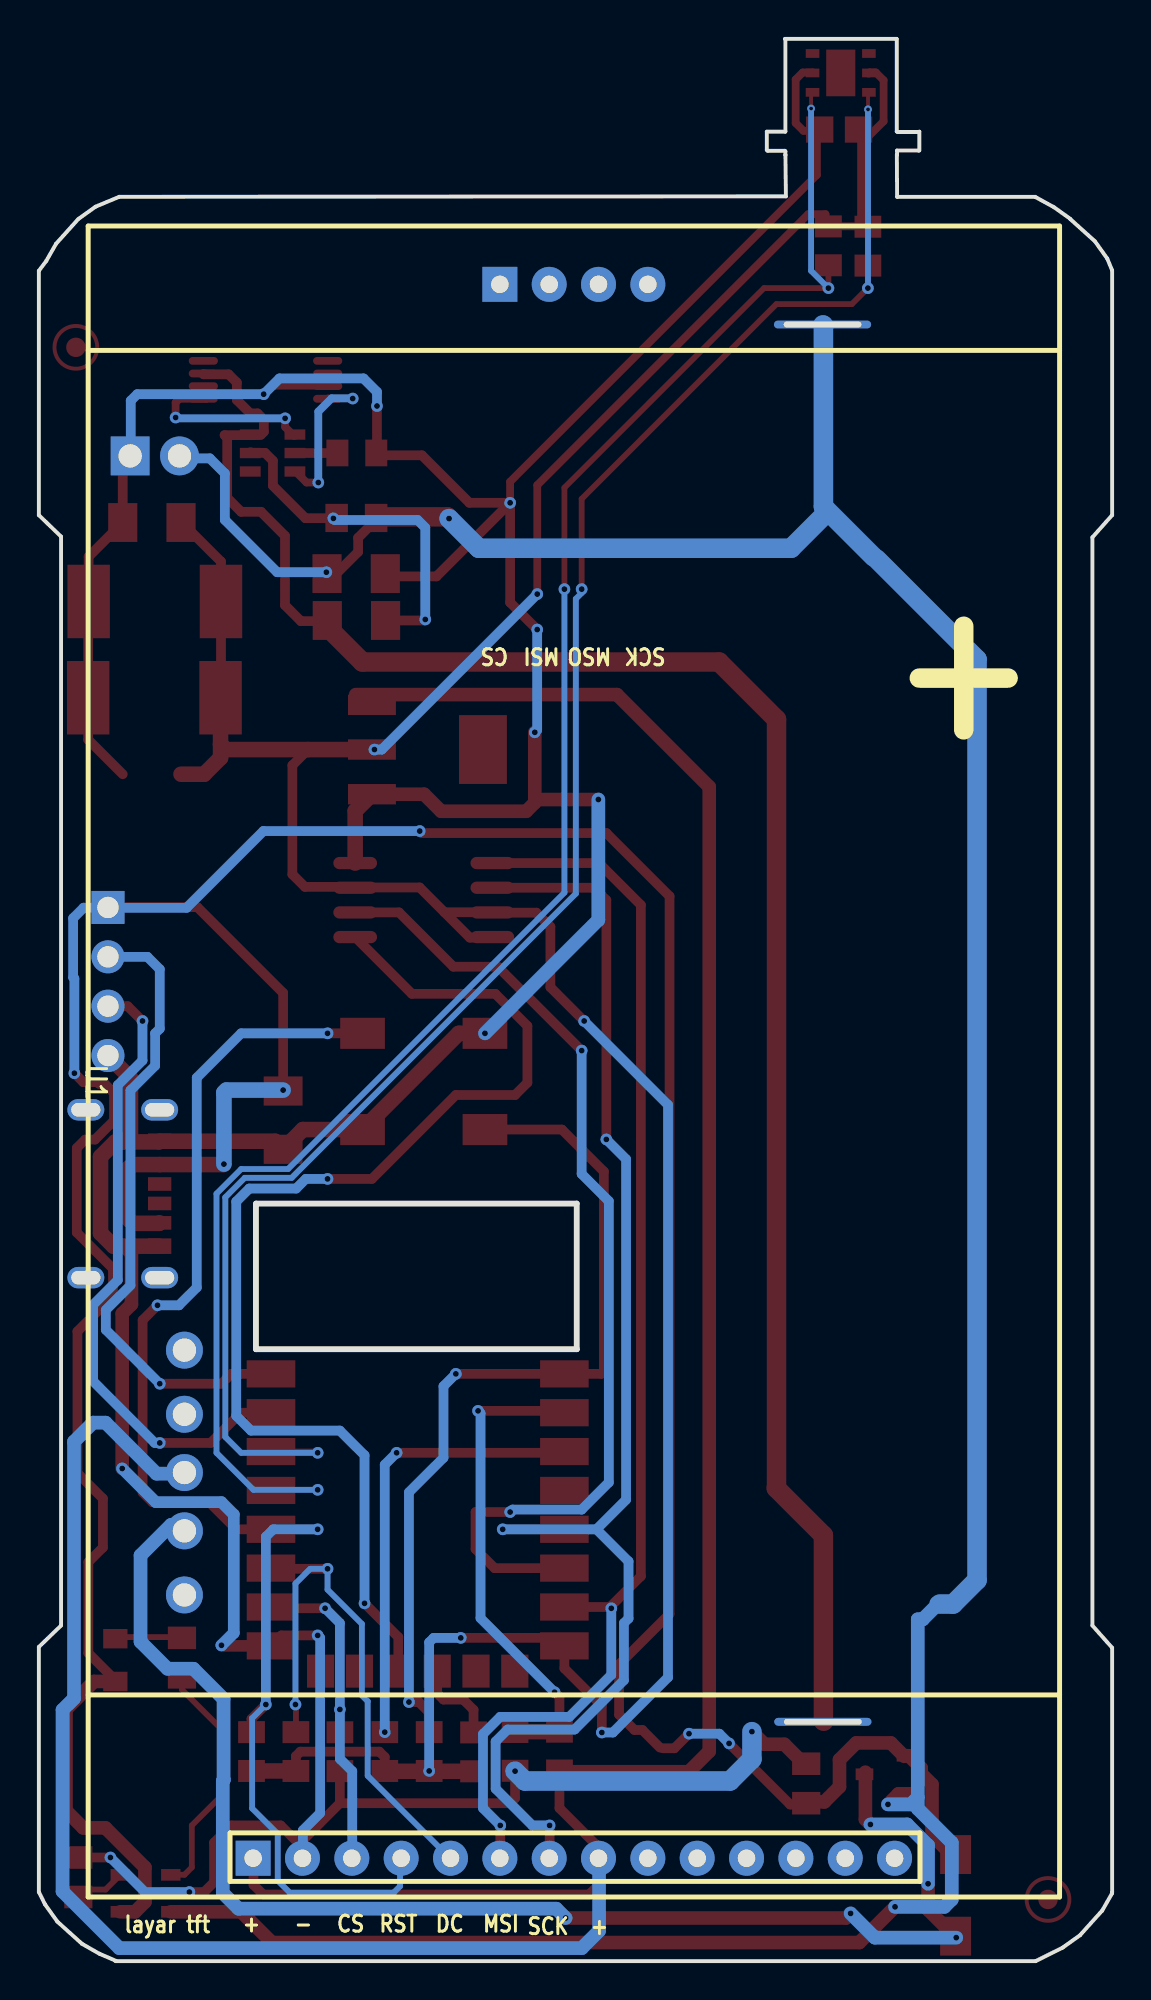
[diagram p5: board, bottom side, seen from below]

Outline 55.25 x 98.93 mm; copper layers: Top Layer, Bottom Layer. Coordinates in mm from the lower left corner of the outline.
Outline path: 0,87 0,74.42 1.02,73.28 1.02,17.27 0,16.13 0,3.56 0,3.49 0.51,2.6 1.65,1.33 2.54,0.7 3.94,0 51.31,0 ; 0,87.03 0.25,87.63 0.89,88.52 2.16,89.66 ; 2.15,89.67 2.99,90.27 3.96,90.8 11.07,90.8 11.08,92.96 11.07,92.97 11.07,93.19 9.97,93.19 9.95,93.2 ; 9.92,93.19 9.92,94.16 9.94,94.14 11.06,94.14 11.09,94.17 11.09,98.92 11.1,98.93 16.83,98.93 16.82,98.92 16.82,94.17 16.83,94.16 17.78,94.16 17.78,93.22 17.73,93.17 16.85,93.17 16.82,93.14 16.82,92.95 ; 16.83,92.97 16.82,92.96 16.79,90.83 51.1,90.81 52.32,90.3 53.21,89.66 54.36,88.39 54.86,87.5 55.25,87 55.25,74.42 54.1,73.32 54.1,17.27 55.25,16.17 55.25,3.56 54.93,2.92 54.29,2.04 53.02,0.89 52.14,0.38 51.25,0 ; 27.56,38.99 27.56,31.5 27.56,31.5 44.07,31.5 44.07,31.5 44.07,38.99 27.56,38.99
Stack: Top Layer 0.035mm / Dielectric1 1.51mm FR4 er 4.5 / Bottom Layer 0.035mm

## Design rules (mm)
spacing Default (default): track to track 0.152, other pairs 0 to 0.152
track width Default (default): min 0.2, default 0.2, max 25.4
differential pair differentialPair (default): width min 0.127, default 0.254, max 2.54; gap min 0.152, default 0.152
via Default (default): diameter min 0.6, default 0.6, max 100.025; hole min 0.305, default 0.305, max 59.995

## Placement (name value [footprint] x y rotation side)
1K  100K  [R0805]  28.45 10.81 90 top
220  100K  [R0805]  30.73 10.8 90 top
+1  MY-18650-01  [BAT-TH_MY-18650-01]  14.91 80.43 270 top
-1  MY-18650-01  [BAT-TH_MY-18650-01]  14.89 16.12 90 top
AMS1117  AMS1117-3.3_C426566  [SOT-223_L6.5-W3.5-P2.30-LS7.0-BR]  35.24 62.36 0 top
AO3401  AO3401  [SOT-23-3_L2.9-W1.4-P1.90-LS2.6-BR]  11.69 9.62 180 top
C2  CSMD  [CAPACITOR-SMD]  38.91 71.41 180 top
C3  470uF  [CAP-SMD_L7.3-W4.3]  49.28 69.98 180 top
C4  CSMD  [CAPACITOR-SMD]  49.43 74.04 180 top
C6  4.7uf  [CAPACITOR-SMD]  42.67 43.28 90 top
C7  CSMD  [CAPACITOR-SMD]  38.9 69 0 top
C8  470uF  [CAP-SMD_L7.3-W4.3]  49.3 65.02 180 top
C9  100nF  [C0805]  14.05 94.27 180 top
D1  1N4001  [SMA_L4.3-W2.5-LS5.0-RD]  8.06 3.38 90 top
DW01A  DW01A  [SOT-23-6_L2.9-W1.6-P0.95-LS2.8-BL]  43.21 77.62 270 top
H2  PZ254V-11-02P  [HDR-TH_2P-P2.54-V-M]  49.28 77.47 180 top
HTU  HTU21D  [DFN-6_L3.0-W3.0-P1.00-BL-EP]  13.97 97.18 90 top
MCP  MCP73831T-2ACI/OT  [SOT-23-5_L3.0-W1.7-P0.95-LS2.8-BR]  49.75 3.49 180 top
P1  -  [FIDUCIAL_MARK]  53.34 83.06 0 top
P2  -  [FIDUCIAL_MARK]  3.3 3.18 0 top
PROG  switch  [TACTILE-SWITCH-1101NE]  35.43 47.75 180 top
Q2  FS8205A  [TSSOP-8_L4.4-W3.0-P0.65-LS6.4-BL-2]  43.58 81.39 270 top
R1  10kΩ  [R0805]  44.3 10.79 90 top
R2  10kΩ  [R0805]  42.01 10.79 90 top
R3  10kΩ  [R0805]  39.75 10.78 90 top
R4  10kΩ  [R0805]  37.44 10.79 270 top
R5  10kΩ  [R0805]  35.16 10.79 270 top
R6  10kΩ  [R0805]  32.87 10.77 90 top
R7  10K  [0805]  15.75 9.14 270 top
R8  2k  [0805]  53.21 4.32 270 top
R9  330  [0805]  47.88 15.62 90 top
R10  1kΩ  [R0805]  38.88 77.62 0 top
R11  100  [0805]  38.9 74.28 180 top
R104  10kΩ  [R0805]  14.6 88.28 270 top
R114  10kΩ  [R0805]  12.57 88.27 270 top
RST  switch  [TACTILE-SWITCH-1101NE]  35.43 42.8 0 top
SW1  SS12F23G5  [SW-TH_SHOU-HAN_SS12F23G5]  47.75 25.15 270 top
U1  ILI9341  [ILI9341-2.8]  52.7 3.3 90 bottom
U2  白光0805LED  [LED0805-RD_WHITE]  51.31 15.49 270 top
U3  2.4GHz  [WIFIM-SMD_ESP-12F-ESP8266MOD]  35.75 22.58 270 top
U4  W25Q64JWSSIQ  [SOIC-8_L5.3-W5.3-P1.27-LS8.0-BL]  35.43 54.61 90 top
UPLOAD  RXTX  [HDR-TH_4P-P2.54-V-M]  51.69 50.42 270 top
USB2  TYPE-C 6P  [TYPE-C-SMD_TYPE-C-6P]  50.93 39.5 90 top

## Footprints (pads in the part's own frame, mm; a bottom-side part is the same pattern mirrored in y, then rotated)
0805
  rect 1.16x1.45 smd: 1(-1.016,0) 2(1.016,0)
BAT-TH_MY-18650-01
  oval 0.4x5 hole 0.3x4: 1(-3.8,-0.001)
C0805
  rect 1.41x1.35 smd: 1(-1,0) 2(1,0)
CAP-SMD_L7.3-W4.3
  rect 2.185x3.78 smd: 1(3.406,0) 2(-3.406,0)
CAPACITOR-SMD
  custom 1.5x2 smd: 1(-1.5,0) 2(1.5,0)
DFN-6_L3.0-W3.0-P1.00-BL-EP
  rect 0.45x0.701 smd: 1(-1,-1.45) 2(0,-1.45) 3(1,-1.45) 4(1,1.45) 5(0,1.45) 6(-1,1.45)
  rect 2.4x1.5 smd: 7(0,0)
FIDUCIAL_MARK
  round 1 smd: MARK(0,0)
HDR-TH_2P-P2.54-V-M
  rect 2x2 hole 1.2: 1(-1.27,0)
  round 2 hole 1.2: 2(1.27,0)
HDR-TH_4P-P2.54-V-M
  rect 1.7x1.7 hole 1.1: 1(-3.81,0)
  round 1.7 hole 1.1: 2(-1.27,0) 3(1.27,0) 4(3.81,0)
ILI9341-2.8
  rect 1.8x1.8 hole 0.9: 1(1.996,-8.489) 15(82.997,-21.189)
  round 1.8 hole 0.9: 2(1.994,-11.028) 3(1.994,-13.569) 4(1.994,-16.108) 5(1.994,-18.648) 6(1.994,-21.189) 7(1.994,-23.729) 8(1.994,-26.266) 9(1.994,-28.806) 10(1.994,-31.346) 11(1.994,-33.886) 12(1.994,-36.426) 13(1.994,-38.966) 14(1.994,-41.506) 16(82.997,-23.729) 17(82.997,-26.266) 18(82.997,-28.806)
LED0805-RD_WHITE
  rect 1x1.25 smd: 1(-1.1,0) 2(1.1,0)
R0805
  rect 1.133x1.377 smd: 1(-1,0) 2(1,0)
SMA_L4.3-W2.5-LS5.0-RD
  rect 2x1.593 smd: 1(-2.1,0) 2(2.1,0)
SOIC-8_L5.3-W5.3-P1.27-LS8.0-BL
  oval 0.63x2.25 smd: 1(-1.905,-3.53) 2(-0.635,-3.53) 3(0.635,-3.53) 4(1.905,-3.53) 5(1.905,3.53) 6(0.635,3.53) 7(-0.635,3.53) 8(-1.905,3.53)
SOT-23-3_L2.9-W1.4-P1.90-LS2.6-BR
  rect 0.91x0.6 smd: 1(1.055,-0.955) 2(1.055,0.955) 3(-1.055,0)
SOT-23-5_L3.0-W1.7-P0.95-LS2.8-BR
  rect 1x0.6 smd: 1(1.3,-0.95) 2(1.3,0) 3(1.3,0.95) 4(-1.3,0.95) 5(-1.3,-0.95)
SOT-23-6_L2.9-W1.6-P0.95-LS2.8-BL
  rect 0.532x1.072 smd: 1(-0.95,-1.149) 2(0,-1.149) 3(0.95,-1.149) 4(0.95,1.149) 5(0,1.149) 6(-0.95,1.149)
SOT-223_L6.5-W3.5-P2.30-LS7.0-BR
  rect 2.465x1.05 smd: 1(2.857,-2.3) 2(2.857,0) 3(2.857,2.3)
  rect 2.465x3.54 smd: 4(-2.857,0)
SW-TH_SHOU-HAN_SS12F23G5
  round 1.9 hole 1.2: 1(-3,0) 2(0,0) 3(3,0) 4(6.3,0) 5(-6.3,0)
TACTILE-SWITCH-1101NE
  rect 2.3x1.6 smd: P$1(-3.15,0) P$2(3.15,0)
TSSOP-8_L4.4-W3.0-P0.65-LS6.4-BL-2
  oval 0.4x1.5 smd: 1(-0.975,-3.2) 2(-0.325,-3.2) 3(0.325,-3.2) 4(0.976,-3.2) 5(0.976,3.2) 6(0.325,3.2) 7(-0.325,3.2) 8(-0.975,3.2)
TYPE-C-SMD_TYPE-C-6P
  oval 1.1x1.9 hole 0.7x1.5: 7(-4.32,1.9) 7(-4.32,-1.9) 7(4.32,1.9) 7(4.32,-1.9)
  rect 0.7x1.2 smd: A5(-0.5,1.9) A9(1.5,1.9) B5(0.5,1.9) B9(-1.5,1.9)
  rect 0.8x1.2 smd: A12(2.7,1.9) B12(-2.7,1.9)
WIFIM-SMD_ESP-12F-ESP8266MOD
  rect 1.4x2.5 smd: 1(-7.651,-7.551) 2(-5.651,-7.551) 3(-3.651,-7.551) 4(-1.651,-7.551) 5(0.349,-7.551) 6(2.349,-7.551) 7(4.349,-7.551) 8(6.349,-7.551) 9(6.349,7.548) 10(4.349,7.55) 11(2.349,7.551) 12(0.349,7.551) 13(-1.651,7.55) 14(-3.651,7.551) 15(-5.651,7.551) 16(-7.651,7.551)
  rect 1.7x1.4 smd: 17(7.651,-5) 18(7.649,-3.002) 19(7.649,-1.004) 20(7.649,0.998) 21(7.649,2.997) 22(7.651,4.997)

## Nets
As in the schematic.

Pads without a net: AMS1117 4; DW01A 4; HTU 3 4 7; P1 MARK; P2 MARK; Q2 1 2 6 8; SW1 1 4 5; U1 9 10 11 12 13 14 15 16 17 18; U3 17 18 21 22; USB2 7 A5 B5

## Via types
v1: diameter 0.6, hole 0.305, Top Layer to Bottom Layer, 73 vias
v2: diameter 0.4, hole 0.2, Top Layer to Bottom Layer, 2 vias

## Routing (per net, layer and track width the routed paths; a pad name or vN(x,y) marks a point on that pad's centre or on a via; arc(x,y) is an arc through that point)
3.3V: length 176.5
  Top Layer w0.4: 13.03,93.84 12.92,93.74 ; 12.92,93.74 12.82,93.63 11.76,94.69 11.76,96.8 12.16,97.2 12.47,97.2 12.53,97.14 ; 12.92,93.74 12.92,93.89 ; 12.92,93.74 12.92,89.66 12.57,89.31 ; 12.92,93.89 12.92,94.35 ; 12.92,93.89 12.87,93.94 ; 12.5,89.29 14.67,89.29 ; v1(29.59,70.36) 29.59,75.97 15.64,89.91 14.75,89.91 14.75,89.36 14.54,89.15
  Top Layer w0.5: 45.89,65.02 45.87,65.05 C3.1 45.87,72.03 47.88,74.04 ; R4.2 37.44,10.5 37.72,10.78 41.78,10.78 42.01,10.55 R2.1 ; 31.9,53.96 29.64,53.96 28.91,53.24 28.91,50.12 v1(27.18,48.39) ; 34.37,53.98 31.94,53.98 ; 34.37,53.98 35.64,55.26 38.88,55.26 ; 34.37,53.98 33.06,52.68 31.74,52.68 ; 41.38,62.36 42.2,61.55 42.2,55.94 41.55,55.29 38.93,55.29 ; v1(33.53,16.64) 28.61,16.64 U3.8 28.19,15.07 26.27,13.14 v1(26.27,11.77)
  Top Layer w0.8: AMS1117.2 45.62,62.36 45.89,62.63 ; R4.2 37.42,9.77 R6.1 ; 45.89,62.63 45.89,61.93 46.74,61.09 47.93,61.09 ; 45.89,62.63 45.89,65.02 ; R2.1 R1.1
  Bottom Layer w0.5: v1(35.16,9.79) 35.16,16.41 34.92,16.64 v1(33.53,16.64) ; v1(27.18,48.39) 22.86,44.07 22.86,14.61 25.7,11.77 v1(26.27,11.77) ; v1(37.97,62.36) 37.59,62.36 v1(29.59,70.36)
5V: length 196.7
  Top Layer w0.5: v1(21.78,11.71) 22.53,10.96 23.12,10.96 ; 23.27,10.99 24.18,11.9 24.59,11.9 25.38,12.69 25.38,15.27 22.78,17.87 22.78,54.81 26.03,58.06 35.54,58.06 v1(35.64,58.16) ; 51.45,54.25 47.09,54.25 42.67,49.83 v1(42.67,44.83) ; v1(53.42,45.7) 52.96,45.24 52.23,45.24 52.15,45.16 51.86,45.16 51.38,44.68 51.38,43.26 52.36,42.28 52.86,42.28 53.29,41.85 53.29,37.5 51.43,35.64 51.43,34.24 53.26,32.41 53.26,25.12 51.95,23.81 51.95,21.29 52.7,20.54 52.7,15.85 51.2,14.35 ; 15.59,8.23 15.76,8.06 16.57,8.06 v1(19.72,11.21)
  Top Layer w0.7: 8.1,5.31 9.27,6.48 9.27,9.09 9.83,9.65 9.83,9.94 10.46,10.57 10.65,10.57 ; 10.7,10.54 11.39,11.23 13.17,11.23 14.03,10.37 14.03,8.97 14.81,8.2 15.73,8.2 ; 51.31,14.39 52.41,14.39 53.85,12.95 53.85,7.75 52.96,6.86 51.82,6.86 49.78,4.83 49.78,3.05 50.29,2.54 MCP.4
  Top Layer w0.8: v1(42.67,44.83) C6.2 ; v1(45.72,41.02) 45.74,41 USB2.A9 50.44,41 50.67,40.77 50.67,38.23 50.42,37.97 49.05,37.97 USB2.B9
  Bottom Layer w0.5: 51.64,54.21 47.64,54.21 43.69,58.16 v1(35.64,58.16) ; v1(19.72,11.21) 20.22,11.71 v1(21.78,11.71) ; 51.71,54.34 51.84,54.22 52.94,54.22 53.48,53.68 53.48,50.64 53.42,50.57 v1(53.42,45.7)
  Bottom Layer w0.8: v1(42.67,44.83) 45.59,44.83 45.72,44.7 v1(45.72,41.02)
GND: length 261.5
  Top Layer w0.4: 15.2,94.15 15.17,94.13 ; 15.2,94.15 15.2,91.93 30.99,76.14 v1(30.99,75.06) ; 15.2,94.15 15.22,94.18 ; v1(43.67,80.65) 43.23,81.08 40.39,81.08 ; 15.38,97.17 15.41,97.2 15.93,97.2 16.29,96.84 16.29,94.6 15.89,94.2 15.19,94.2
  Top Layer w0.5: U3.9 42.76,16.76 v1(40.89,16.76) ; 39.75,8.13 30.99,8.13 30.73,8.38 220.1 ; 39.75,8.13 R3.1 ; 39.75,8.13 41.65,6.23 ; v1(30.99,75.06) 33.08,75.06 35.53,77.5 37.76,77.5 37.78,77.53 ; v1(30.99,75.06) 34.78,71.27 37.41,71.27 ; v1(30.99,75.06) 30.99,69.93 v1(29.59,68.53) ; v1(51.56,5.33) R8.1 ; MCP.2 47.56,3.49 v1(47.5,3.56) 46.74,3.56 46.23,4.06 46.23,6.1 45.34,6.99 42.8,6.99 41.65,5.84 41.65,5.33 ; 50.93,61.09 52.7,62.87 C8.2 52.7,69.95 C3.2 52.68,72.29 C4.1 50.93,77.85 H2.1 ; v1(37.84,80.04) 37.84,77.62
  Top Layer w0.6: v1(45.85,16.26) 45.82,16.23 U3.9
  Top Layer w0.7: v1(29.72,63.25) 29.72,59.83 ; 29.72,59.83 29.72,59.62 30.16,59.18 34.54,59.18 35.41,60.06 AMS1117.1 ; 29.72,59.83 29.67,59.79 v1(26.45,59.79) ; 15.84,10.13 16.87,11.16 17.89,11.16 v1(18.54,11.81) ; v1(50.96,25.35) 50.96,33.33 50.48,33.8 50.48,36.42 50.86,36.8
  Top Layer w0.8: UPLOAD.4 50.53,45.45 50.53,42.52 50.89,42.16 ; AMS1117.1 38.96,59.19 U4.4 ; 50.89,42.16 51.31,42.16 52.07,41.4 52.07,37.47 51.4,36.8 USB2.B12 ; 50.89,42.16 49.06,42.16 USB2.A12 43.09,42.2 C6.1 41.66,42.8 RST.P$2 33.63,47.75 v1(32.28,47.75)
  Top Layer w1: v1(30.73,9.78) 220.1
  Bottom Layer w0.5: v1(29.59,68.53) 29.59,63.37 v1(29.72,63.25) ; v1(47.5,3.56) 49.78,3.56 v1(51.56,5.33) ; 50.53,77.44 50.51,77.46 50.51,80.31 50.18,80.65 v1(43.67,80.65) 42.86,81.46 38.53,81.46 37.84,80.77 v1(37.84,80.04) ; v1(40.89,16.76) 40.77,16.64 40.77,7.62 41.65,6.73 41.65,5.33
  Bottom Layer w0.6: v1(50.96,25.35) 49.22,23.62 45.85,23.62 45.21,22.99 45.21,16.89 v1(45.85,16.26)
  Bottom Layer w0.7: v1(32.28,47.75) 26.45,53.59 v1(26.45,59.79)
  Bottom Layer w1: v1(30.73,9.78) 30.23,9.27 19.67,9.27 18.54,10.4 v1(18.54,11.81)
VBATT: length 171.6
  Top Layer w0.5: 40.38,71.42 39.93,71.42 38.81,72.53 38.81,73.26 37.74,74.32
  Top Layer w0.7: MCP.3 44.83,2.54 43.25,0.96 13.01,0.96 v1(11.18,2.79) ; v1(11.54,8.07) 11,8.61 10.57,8.61
  Top Layer w1: v1(34.13,74.25) 34.22,74.33 37.79,74.33
  Bottom Layer w0.5: v1(40.45,71.49) 42.98,71.49 45.67,74.18 45.67,76.57 46.44,77.34 48.12,77.34
  Bottom Layer w0.7: v1(11.54,8.07) 10.37,8.07 10.01,8.43 ; 10.01,8.43 10.01,17.59 9.75,17.59 ; 10.01,8.43 10.01,7.85 8.25,6.1 8.25,3.18 8.64,2.79 v1(11.18,2.79) ; 9.75,17.59 9.78,17.62 ; 9.75,17.59 9.05,18.29 9.05,18.42
  Bottom Layer w1: v1(34.13,74.25) 32.6,72.72 16.53,72.72 14.69,74.55 ; 12.28,72.27 14.86,74.86 14.86,84.19 14.88,84.21 ; 8.88,18.38 8.19,18.38 6.95,19.61 6.95,67 12.11,72.16
VDD: length 167.5
  Top Layer w0.5: 26.44,5.33 26.42,3.93 26.92,3.43 43.7,3.43 44.2,3.93 44.2,5.33 44.19,5.34 ; 26.44,5.33 26.44,5.87 28.45,7.87 1K.1 ; 26.44,5.33 U1.8
  Top Layer w0.7: 28.46,9.75 21.79,9.75 20.74,10.8 20.74,60.44 25.49,65.18 38.94,65.18
  Bottom Layer w0.7: 26.41,5.03 26.41,1.56 27.3,0.67 51.1,0.67 54.02,3.59 54.02,12.93 53.44,13.52 53.44,26.73 52.46,27.71 51.81,27.71 49.19,25.09 47.81,25.09
ADCEX: length 25
  Top Layer w0.5: 1K.2 28.45,13.59 v1(28.7,13.84) ; U3.2 28.29,28.32 v1(32.64,28.32)
  Top Layer w0.8: 220.2 30.72,11.81 1K.2
  Bottom Layer w0.5: v1(28.7,13.84) 32.51,17.65 32.51,28.19 v1(32.64,28.32)
CS: length 17.4
  Top Layer w0.5: R3.2 v1(39.75,12.95) ; v1(40.51,18.16) 43.23,18.16 U3.10
  Bottom Layer w0.5: v1(40.51,18.16) 39.75,17.4 v1(39.75,12.95) 39.75,10.41 39.11,9.78 39.11,5.33
DC: length 30
  Top Layer w0.3: R2.2 42.01,13.18 v1(42.04,13.21)
  Top Layer w0.5: v1(40.39,20.19) 43.26,20.19 U3.11
  Bottom Layer w0.3: v1(42.04,13.21) 42.04,19.43 41.28,20.19 v1(40.39,20.19) 40.39,19.12 38.62,17.35 38.62,13.68 38.32,13.38 38.32,9.54 34.1,5.32
MISO: length 51.8
  Top Layer w0.5: v1(30.99,23.11) 32.77,23.11 32.77,21.21 31.78,20.23 U3.6 ; U4.2 36.7,53.98 33.91,51.18 31.62,51.18 v1(27.31,46.86)
  Bottom Layer w0.5: v1(27.31,46.86) 27.31,40.51 25.91,39.12 25.91,24.64 27.31,23.24 30.86,23.24 v1(30.99,23.11)
MOSI: length 65.8
  Top Layer w0.5: v1(31.5,6.99) 31.49,6.98 31.49,5.33 ; U3.7 25.85,18.23 v1(25.78,18.16) 25.78,18.29 24.26,19.81 24.26,54.36 26.42,56.52 U4.5
  Bottom Layer w0.5: v1(25.78,18.16) 25.78,14.73 27.94,12.57 31.5,12.57 32.38,11.68 32.38,7.87 v1(31.5,6.99)
RST: length 73.8
  Top Layer w0.5: v1(43.56,13.21) 44.3,12.47 R1.2 ; v1(40.39,47.75) PROG.P$1 ; 43.3,22.23 45.09,22.23 46.48,23.62 49.4,23.62 49.9,24.12 49.9,32.99 v1(49.14,33.75) ; v1(40.89,22.23) 43.29,22.23
  Bottom Layer w0.3: v1(43.56,13.21) 44.27,12.5 44.27,7.86 42.95,6.54 42.95,4.15 42.32,3.52 36.99,3.52 36.65,3.85 36.65,5.44
  Bottom Layer w0.5: v1(40.39,47.75) 44.83,47.75 47.12,45.47 47.12,34.67 48.03,33.75 v1(49.14,33.75) ; v1(40.89,22.23) 43.18,22.23 43.56,21.84 v1(43.56,13.21)
RX: length 32.8
  Top Layer w0.5: UPLOAD.3 50.67,49.15 v1(49.91,48.39) ; U3.15 44.85,28.23 46.4,26.67 v1(49.02,26.67)
  Bottom Layer w0.5: v1(49.02,26.67) 49.28,26.67 52.45,29.85 52.45,33.78 51.18,35.05 51.18,45.09 49.91,46.36 v1(49.91,48.39)
SCK: length 71.7
  Top Layer w0.5: U4.6 26.67,55.25 26.03,54.61 v1(26.03,42.29) ; 31.37,22.23 U3.5 ; 28.95,5.33 28.95,6.98 v1(28.96,6.99)
  Bottom Layer w0.5: v1(26.03,42.29) 25.02,41.28 25.02,23.75 26.54,22.23 ; 26.54,22.23 v1(31.37,22.23) ; 26.54,22.23 24.89,20.57 24.89,17.64 25.13,17.4 25.13,14.46 27.67,11.92 31.12,11.92 31.73,11.3 31.73,8.87 29.84,6.99 v1(28.96,6.99)
SCL: length 95.3
  Top Layer w0.2: v2(12.57,95.3) 12.57,96.11 12.52,96.15
  Top Layer w0.3: v1(40.89,26.16) 40.96,26.23 43.3,26.23 ; v1(27.31,70.61) 27.31,75.26 17.28,85.28 13.4,85.28 v1(12.57,86.11) R114.2
  Bottom Layer w0.3: v1(27.31,70.61) 27.31,70.41 27.6,70.11 27.6,54.94 42.23,40.32 44.64,40.32 45.65,39.31 45.65,26.98 44.83,26.16 v1(40.89,26.16) ; v2(12.57,95.3) 12.57,86.11 v1(12.57,86.11)
SDA: length 96.4
  Top Layer w0.2: v2(15.5,95.35) 15.5,96.15 15.46,96.18
  Top Layer w0.3: R104.2 v1(14.6,86.11) 17.92,86.11 28.19,75.83 v1(28.19,70.61) ; U3.13 43.26,24.26 v1(40.89,24.26)
  Bottom Layer w0.3: v1(14.6,86.11) 15.5,87 v2(15.5,95.35) ; v1(40.89,24.26) 44.2,24.26 46.1,26.16 46.1,39.5 44.83,40.77 42.42,40.77 28.19,54.99 v1(28.19,70.61)
SDCS: length 61.5
  Top Layer w0.5: U4.1 36.04,49.78 31.75,49.78 30.1,48.13 30.1,45.21 30.73,44.58 33.78,44.58 38.1,40.26 v1(40.39,40.26) ; U3.20 36.74,16.68 v1(38.48,18.42)
  Bottom Layer w0.5: v1(40.39,40.26) 41.51,40.26 42,39.76 44.41,39.76 45.09,39.09 45.09,28.07 44.32,27.31 39.75,27.31 38.48,26.04 v1(38.48,18.42)
TX: length 32.5
  Top Layer w0.5: U3.16 45.34,30.23 45.85,29.72 v1(49.02,29.72)
  Bottom Layer w0.5: UPLOAD.2 49.66,51.69 49.02,51.05 49.02,47.99 49.26,47.75 49.26,46.09 50.53,44.82 50.53,34.78 51.8,33.51 51.8,32.5 v1(49.02,29.72)
$1N78: length 45.1
  Top Layer w0.5: RST.P$1 28.32,42.8 26.16,40.64 26.16,30.35 26.29,30.23 U3.1 v1(33.78,30.23) ; v1(36.19,13.34) 35.69,13.34 35.18,12.83 35.18,11.81 R5.1
  Bottom Layer w0.5: v1(36.19,13.34) 36.19,24.13 34.42,25.91 34.42,29.59 v1(33.78,30.23)
$1N79: length 23.3
  Top Layer w0.5: v1(36.83,26.16) 28.26,26.16 28.19,26.23
  Bottom Layer w0.5: v1(37.44,11.79) 37.44,25.55 v1(36.83,26.16)
$1N246: length 4.5
  Top Layer w0.5: U3.19 34.74,13.79 34.42,13.46 33.4,13.46 32.87,12.93 R6.2
$3N814: length 12.5
  Top Layer w0.3: 48.45,4.44 48.45,4.45 47.75,4.45 47.37,4.83 47.37,6.99 45.79,8.57 45.79,11.88 47.88,13.97 R9.1
$3N815: length 3.3
  Top Layer w0.3: 48.05,16.68 51.31,16.68
$3N819: length 2.5
  Top Layer w0.3: 53.21,3.68 51.81,3.68 51.05,4.44
$3N1149: length 73.2
  Top Layer w0.7: 12.7,9.72 12.7,7.29 v1(12.44,7.04) ; v1(9.48,3.98) 9.48,2.65 8.12,1.29 ; v1(28.13,2.22) 13.7,2.22 v1(13.46,2.46) ; v1(8.03,1.21) 8.07,1.25
  Bottom Layer w0.7: 47.82,22.45 48.44,22.45 50.01,20.88 50.01,16.44 48.62,15.05 47.29,15.05 45.74,13.49 45.74,9.34 45.72,9.33 45.78,9.27 45.78,3.51 44.97,2.7 28.61,2.7 v1(28.13,2.22) ; v1(8.03,1.21) 12.21,1.21 v1(13.46,2.46) ; v1(9.48,3.98) 9.48,5.96 10.55,7.04 v1(12.44,7.04)
$3N6731: length 8.4
  Top Layer w0.4: v1(40.86,76.1) 41.47,76.1 42.01,76.64 ; v1(39.09,80.42) 40.37,80.42 40.41,80.38
  Bottom Layer w0.4: v1(39.09,80.42) 39.1,80.43 40.18,80.43 40.86,79.75 v1(40.86,76.1)
$3N6752: length 9.2
  Top Layer w0.4: v1(42.57,79.4) 42.57,78.96 42.1,78.49 ; v1(48.2,79.45) 48.2,80.22 48.01,80.41 46.64,80.41 46.63,80.41
  Bottom Layer w0.4: v1(42.57,79.4) 48.16,79.4 v1(48.2,79.45)
$3N6843: length 2.2
  Top Layer w0.5: 39.94,77.62 42.18,77.62
$3N7242: length 98.4
  Top Layer w0.5: 44.28,78.54 43.82,78.56 43.66,78.72 43.66,79.33 43.99,79.66 44.36,79.66 45.05,80.35 45.05,81.25 45.48,81.67 46.76,81.67 46.78,81.68 ; 44.28,78.54 44.2,78.54 ; 44.28,78.54 45.68,78.54 45.55,78.41 45.55,75.31 44.83,74.59 43.81,74.59 42.58,73.36 42.58,69.79 41.76,68.97 40.47,68.97
  Top Layer w1: 17.28,24.33 17.28,63.91 20.23,66.86 38.59,66.86 40.59,68.86 ; 14.84,12.35 14.86,12.37 14.86,21.92 17.3,24.35
$3N7253: length 18.4
  Top Layer w0.5: 40.03,74.26 41.52,74.26 43.2,75.94 43.2,77.22 43.6,77.63 44.31,77.63 44.35,77.66 ; v1(35.35,69.05) 35.41,69 37.57,69
  Bottom Layer w0.5: v1(35.35,69.05) 35.35,73.78 35.75,74.17 40,74.17 v1(40.09,74.26)

## Text on the board
Bottom Silkscreen Layer: + | - | SCK | MSO | MSI | CS | DC | RST | layar tft
Top Silkscreen Layer: +  TX  RX  - | +  - | + | - | 18650
